# Altium schematic sheet main_borad.SCHDOC
size A0
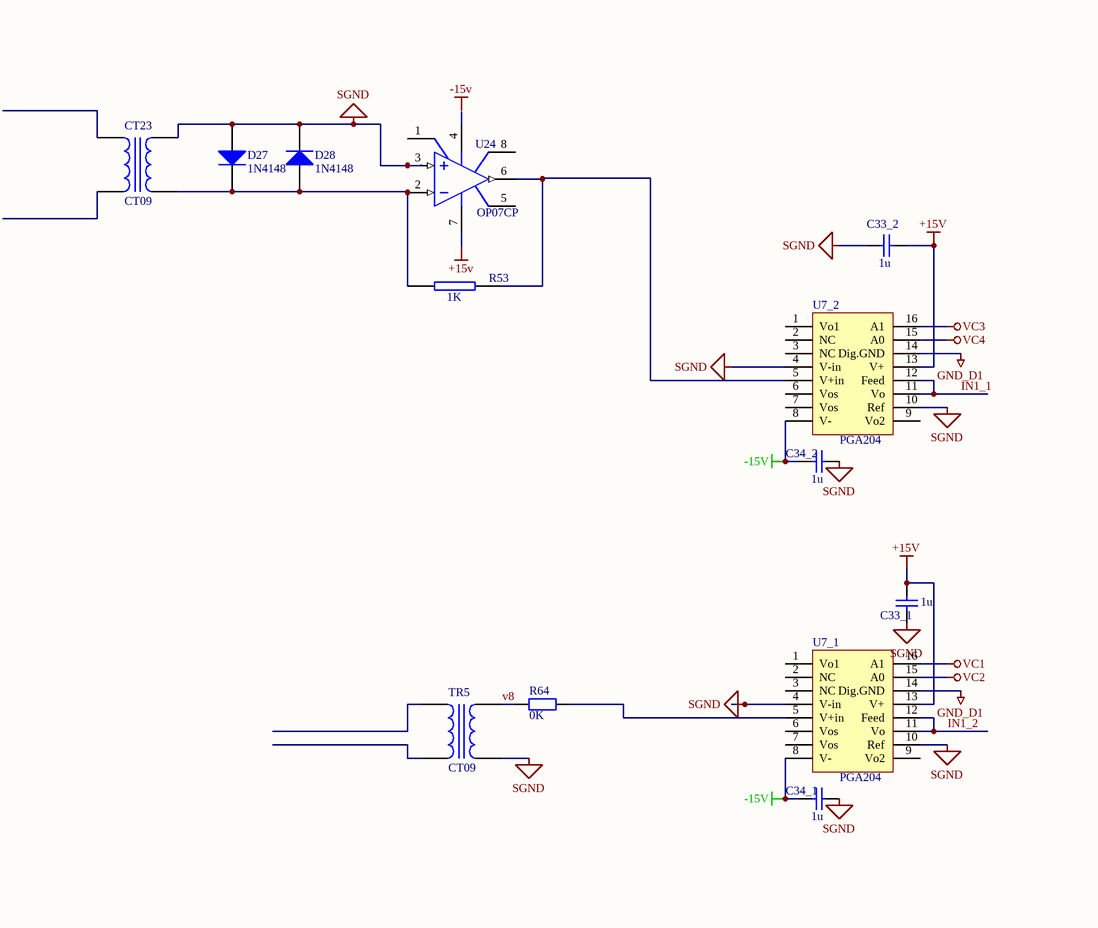
[diagram p0: main_borad.SCHDOC, top left]
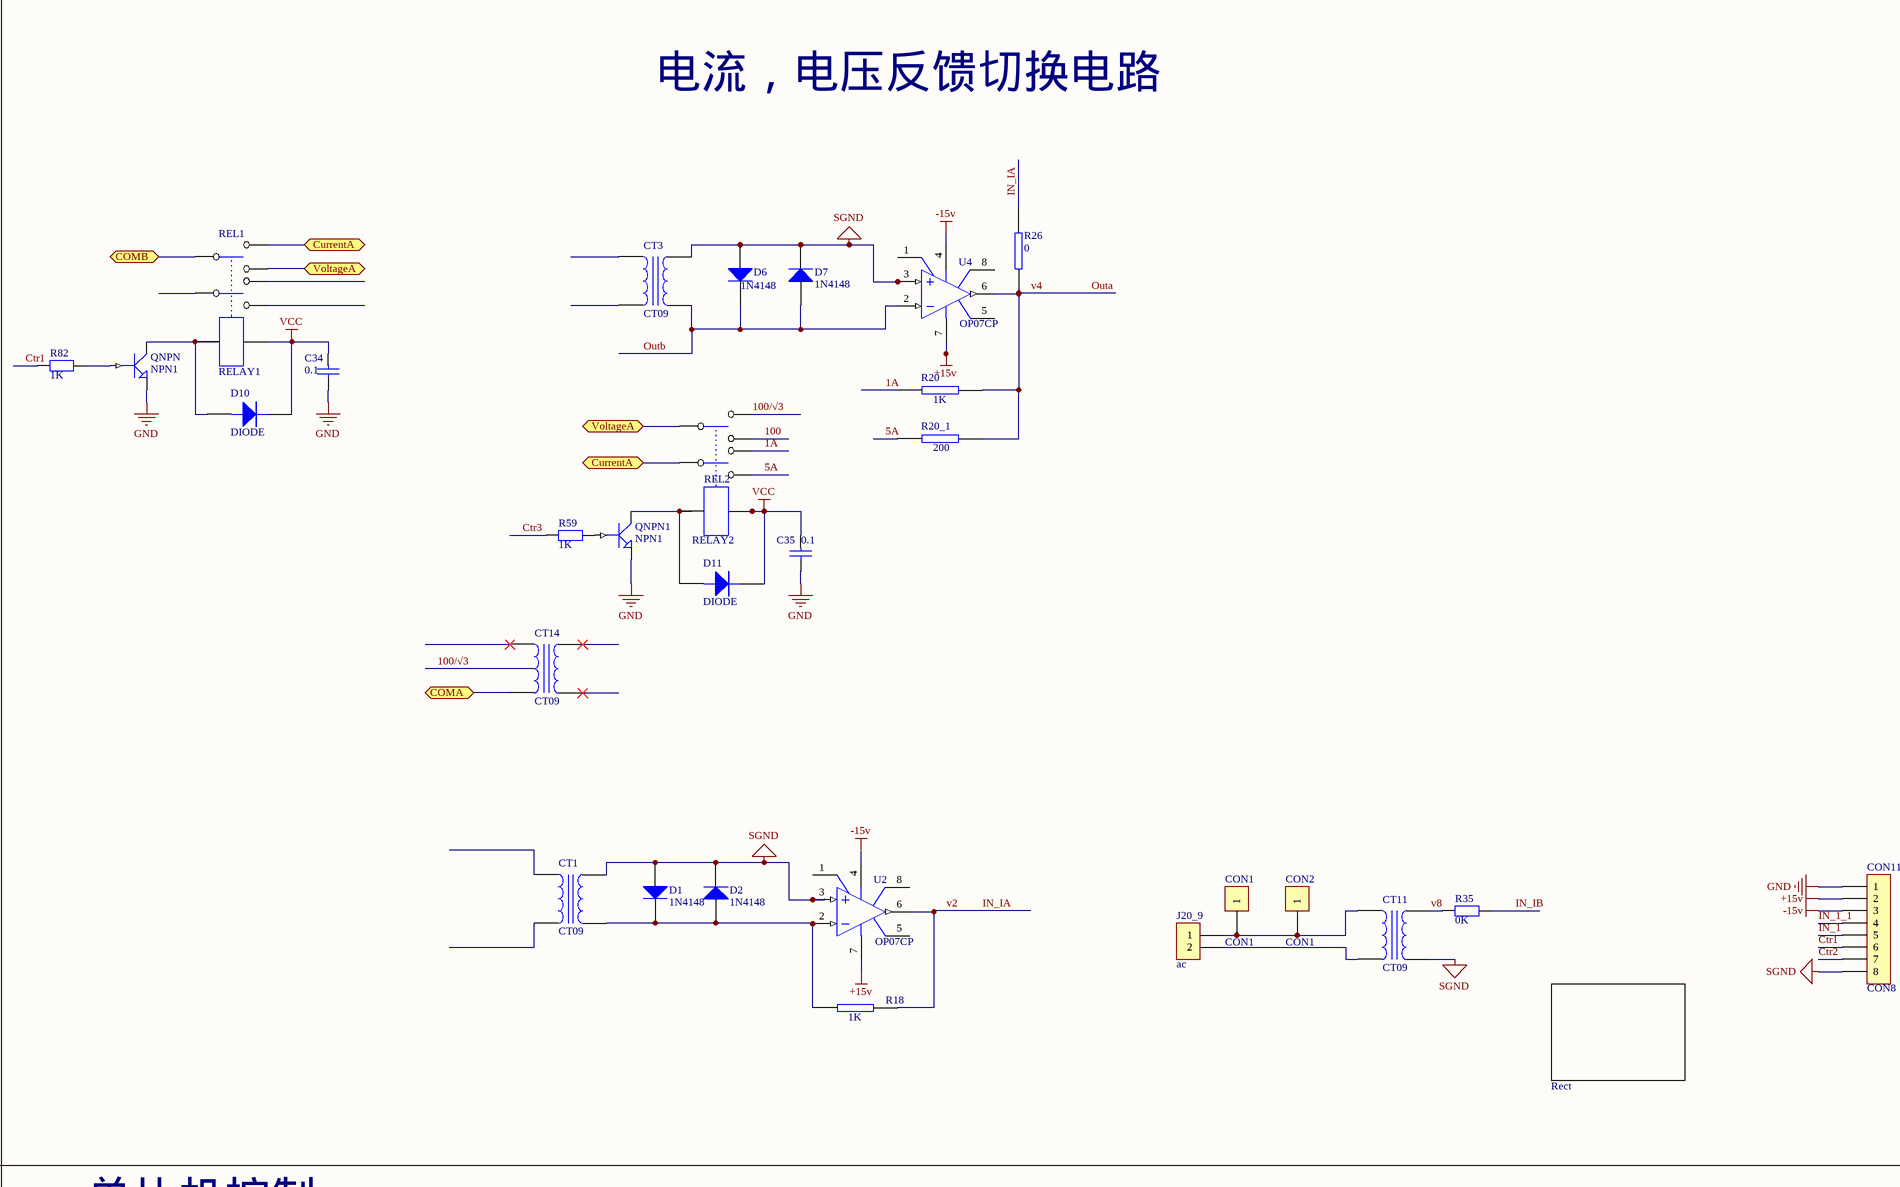
[diagram p1: main_borad.SCHDOC, top middle]
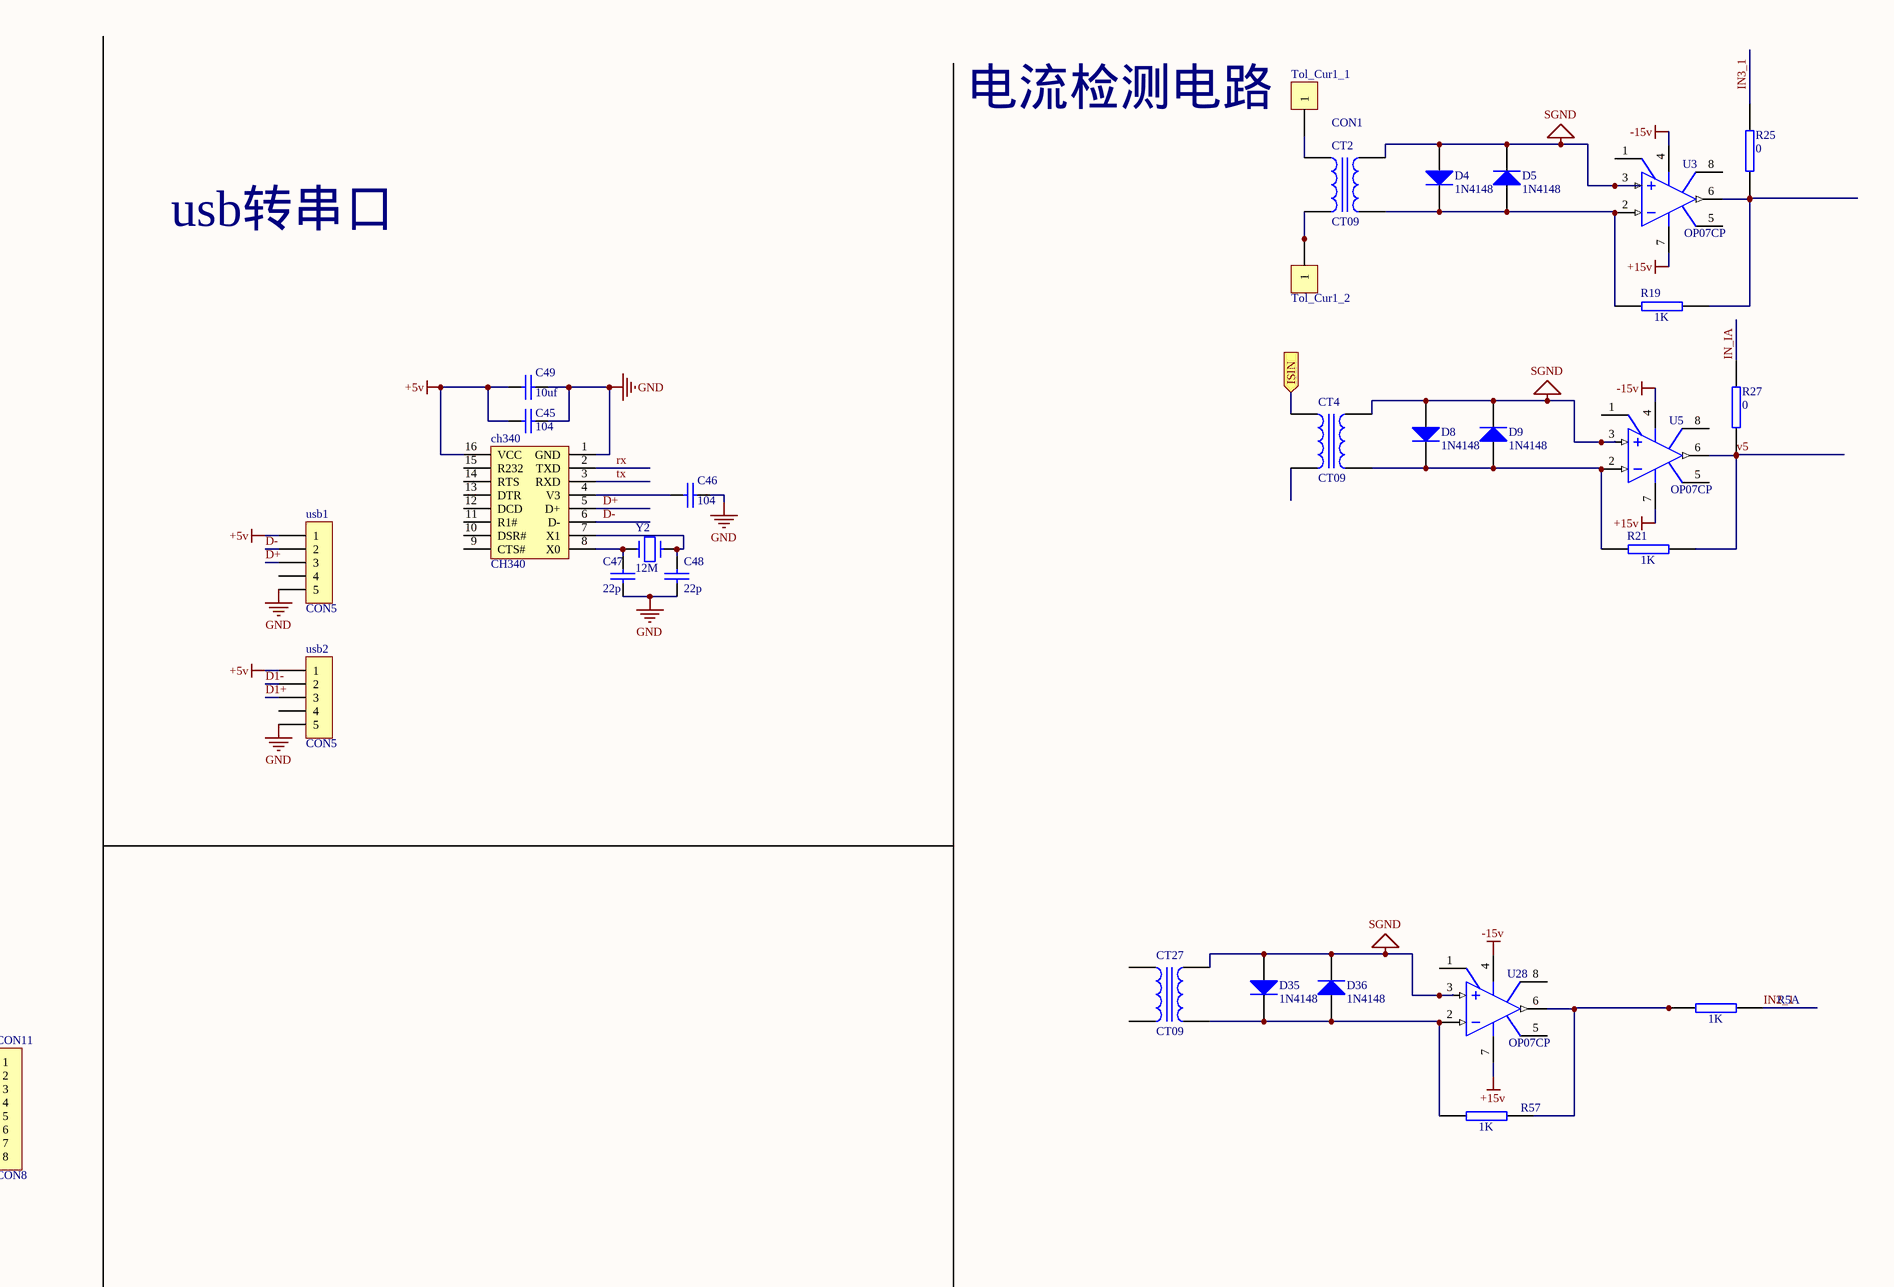
[diagram p2: main_borad.SCHDOC, top right]
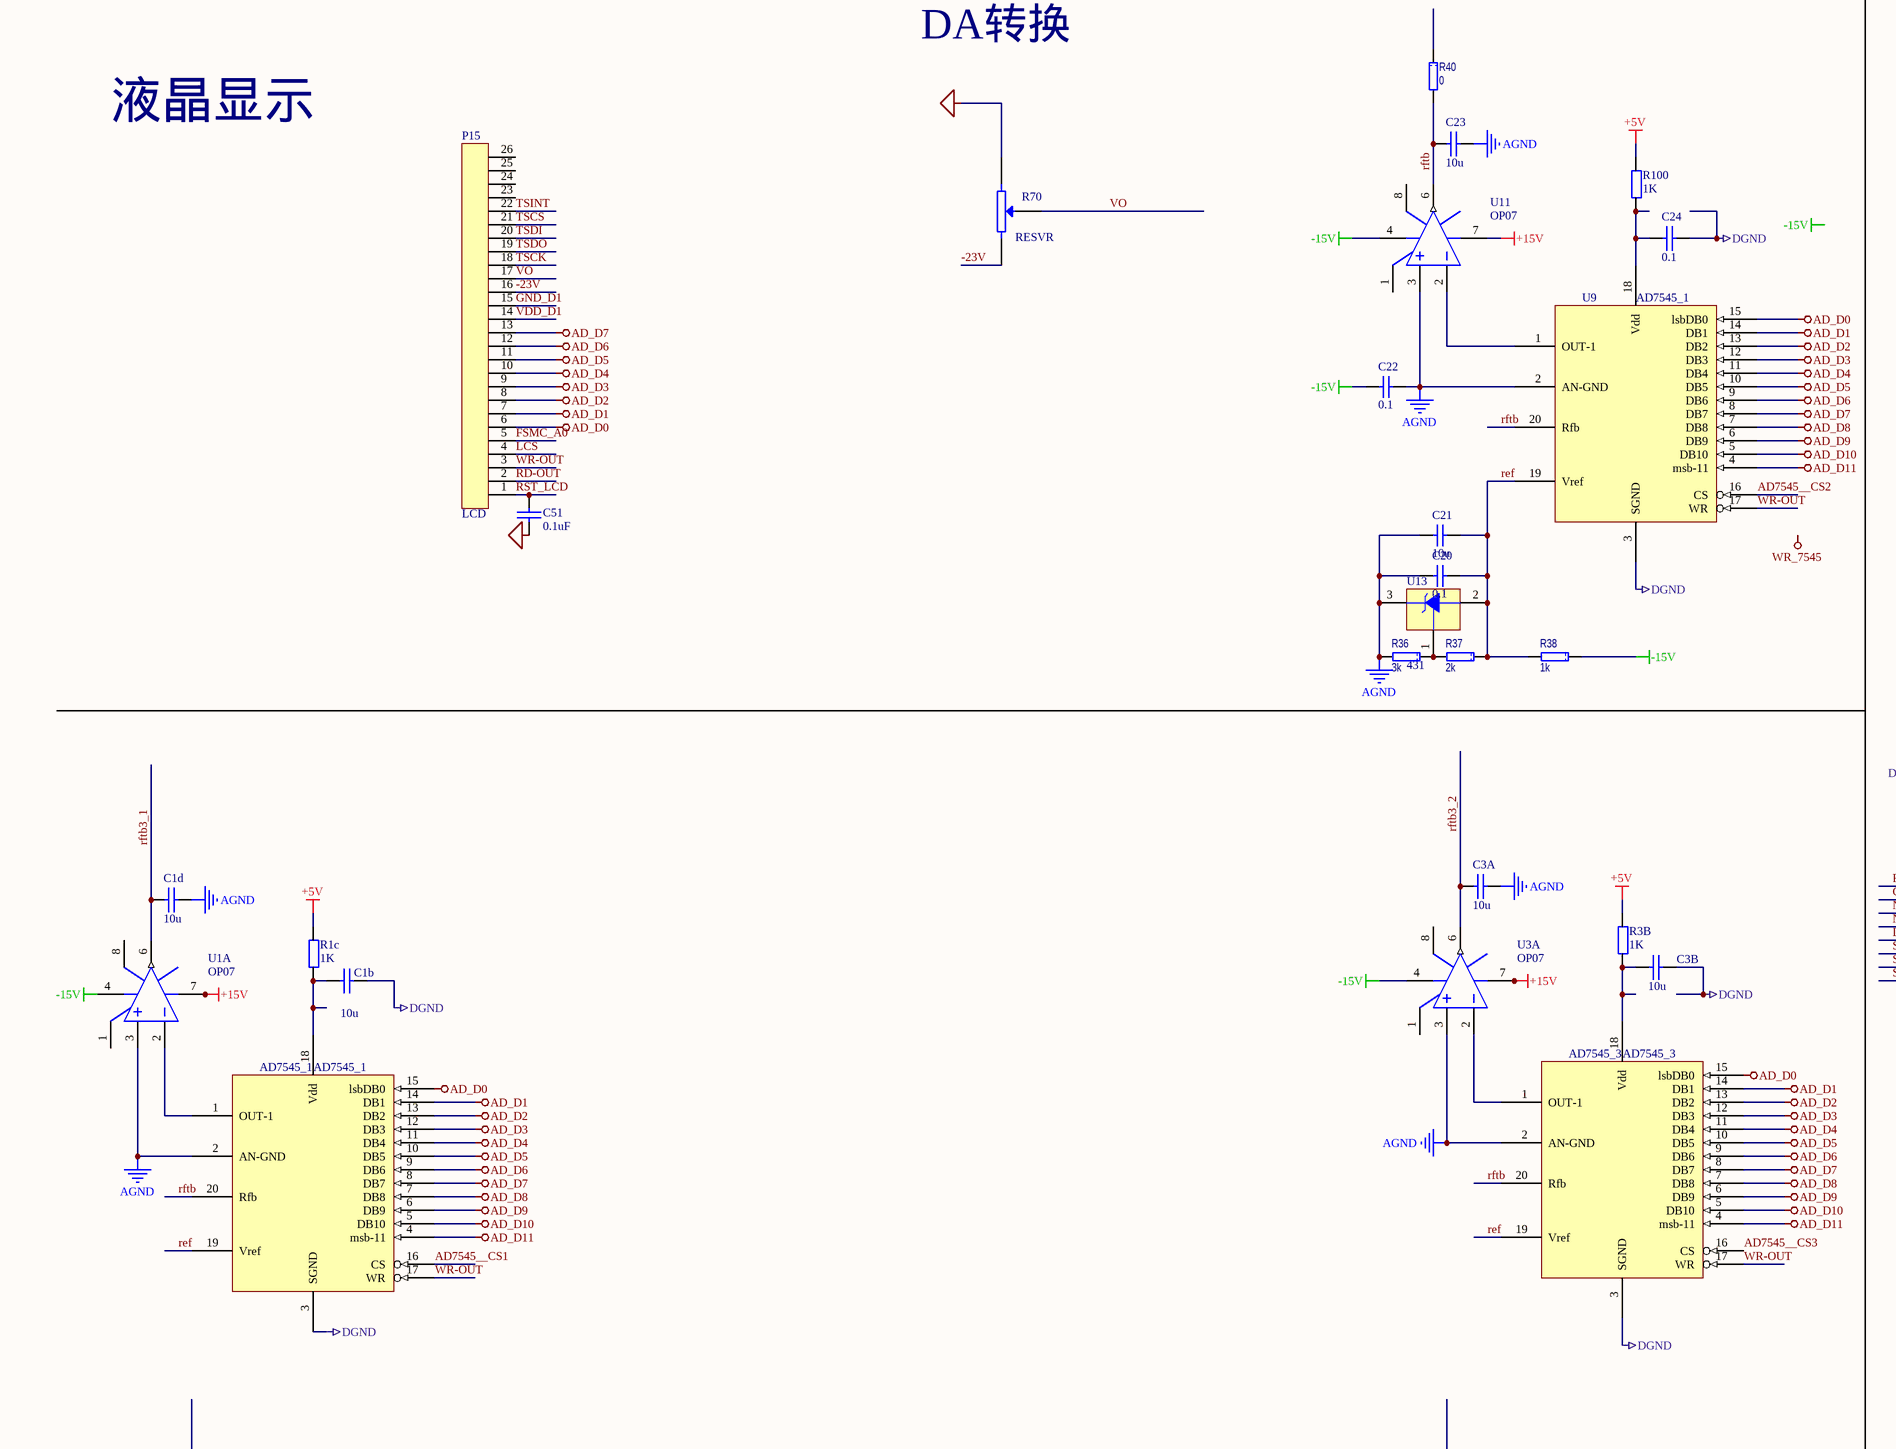
[diagram p3: main_borad.SCHDOC, centre left]
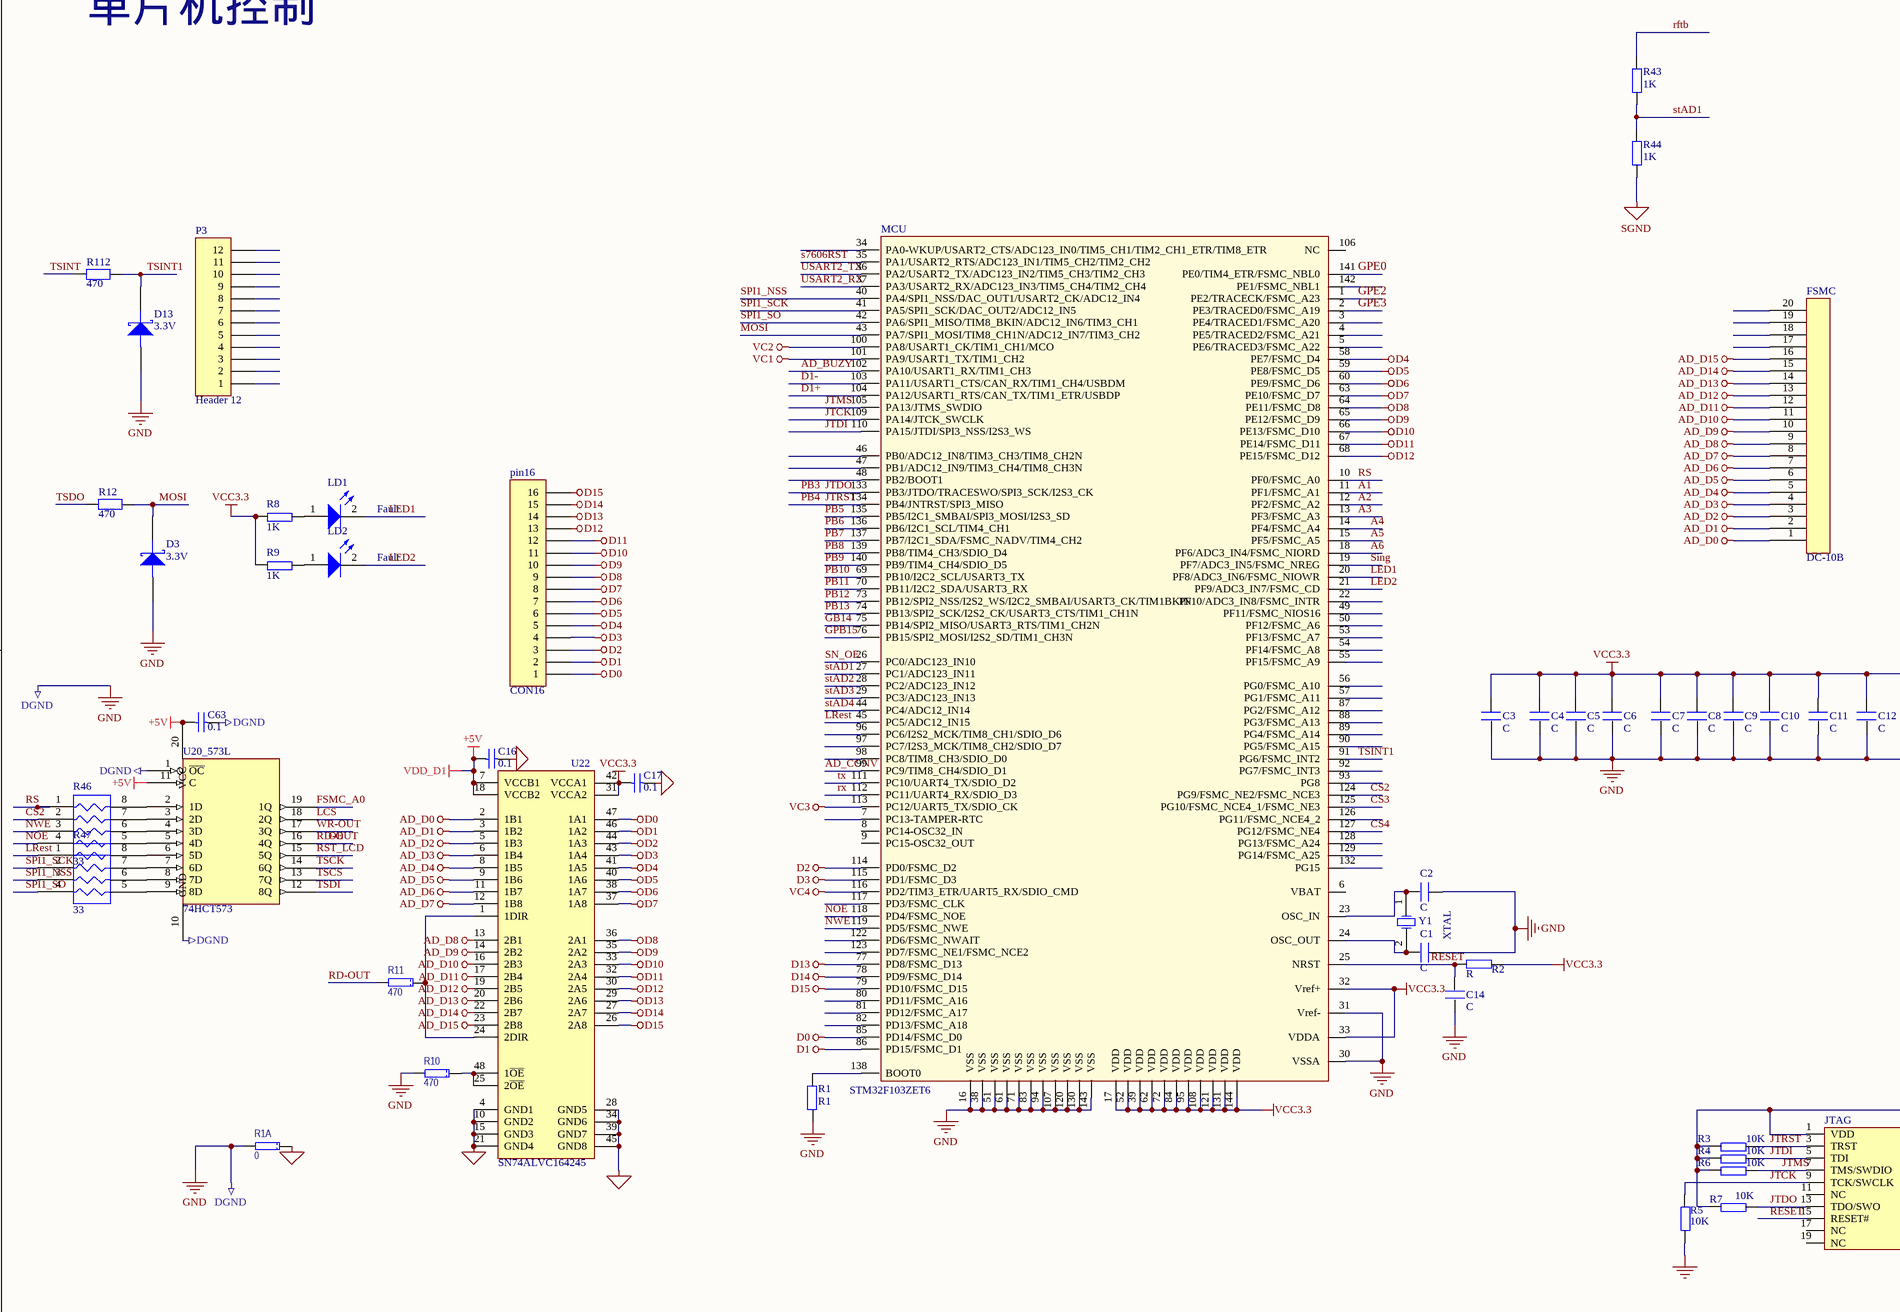
[diagram p4: main_borad.SCHDOC, centre middle]
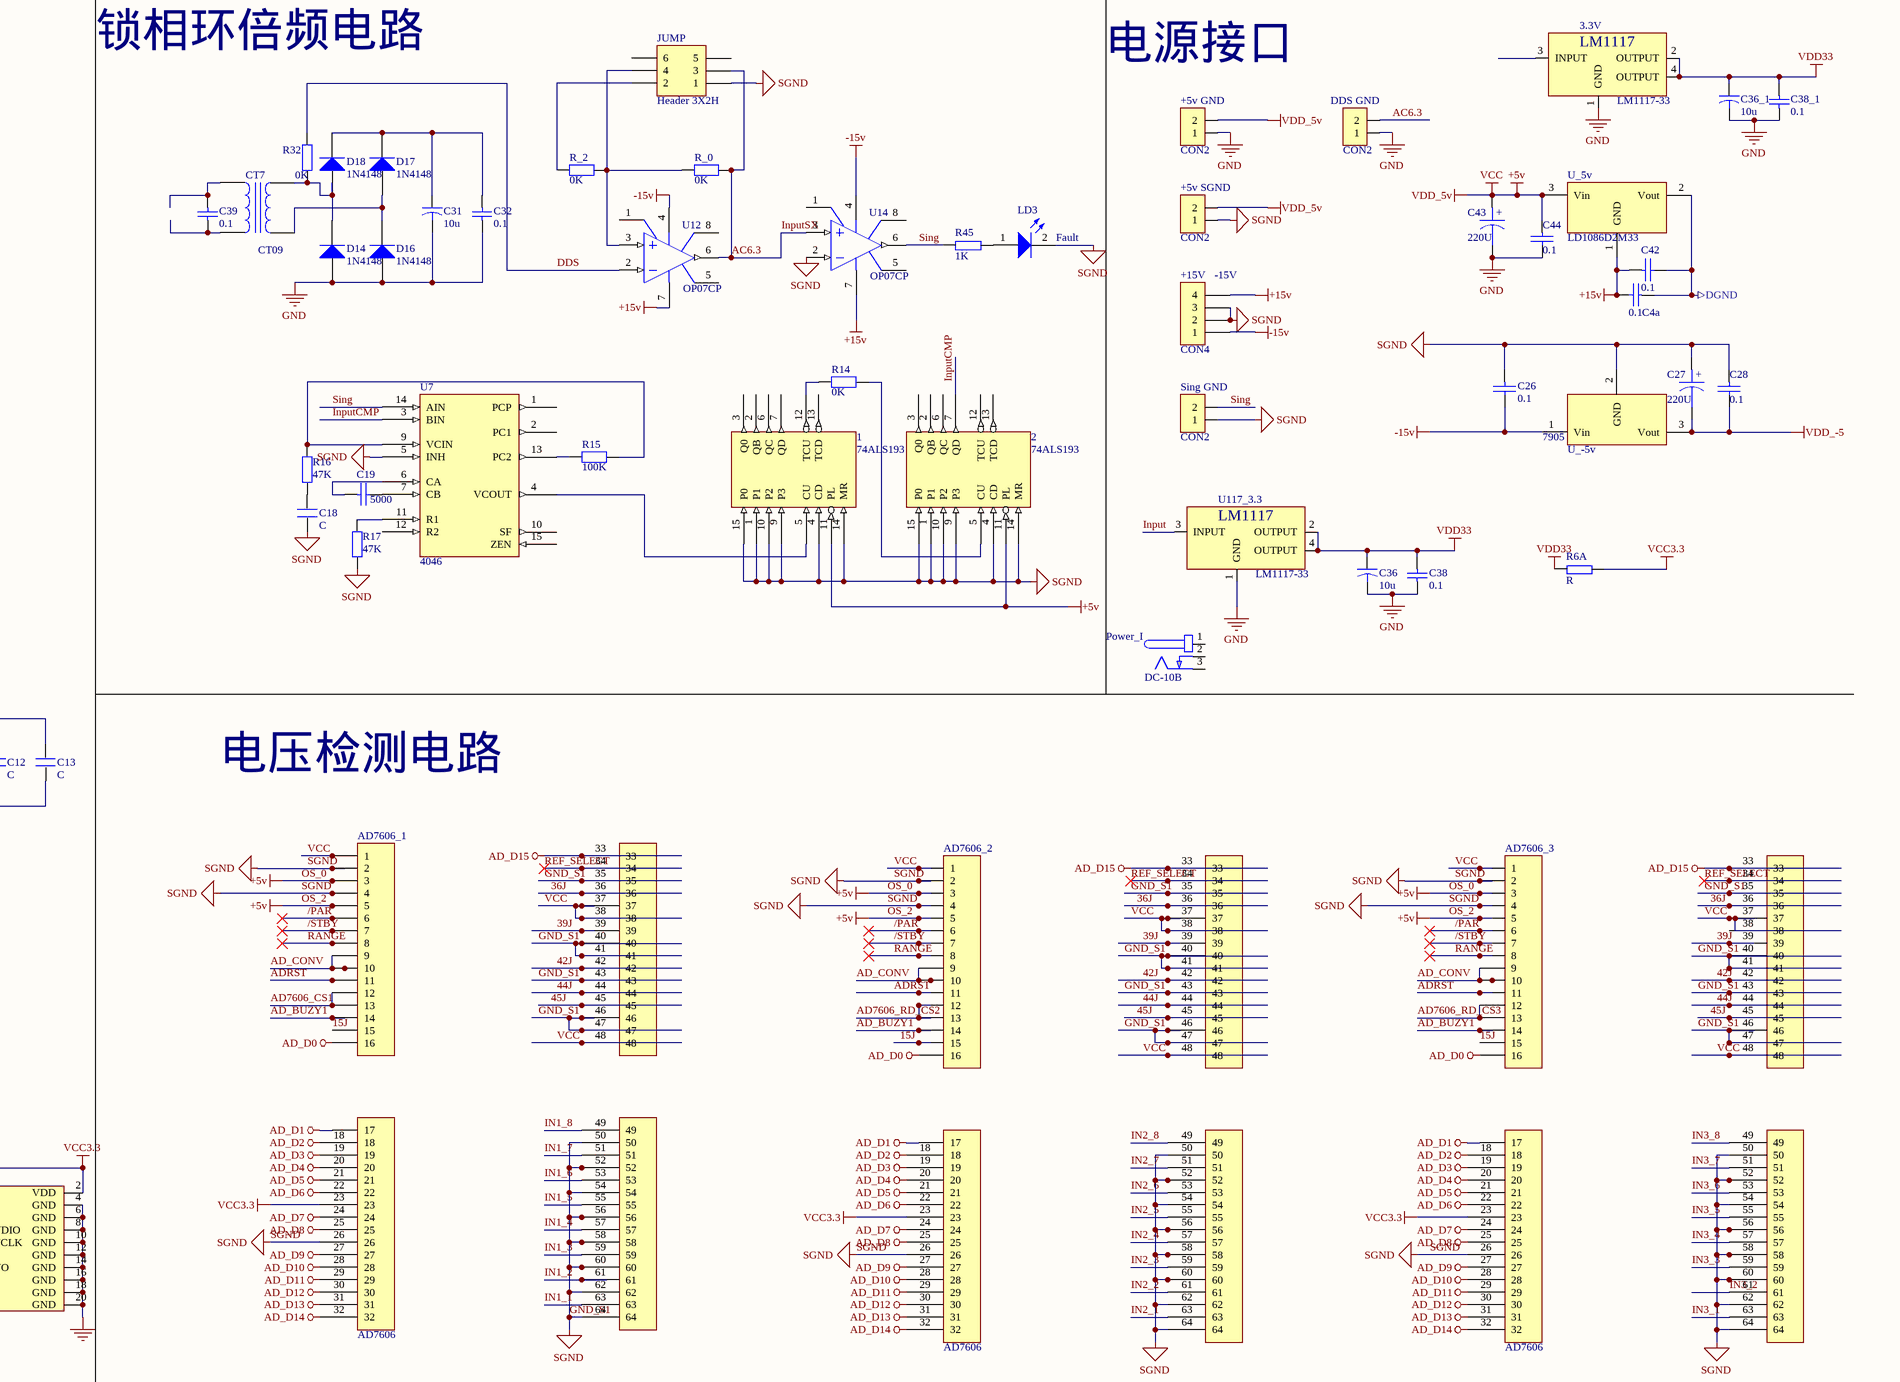
[diagram p5: main_borad.SCHDOC, centre right]
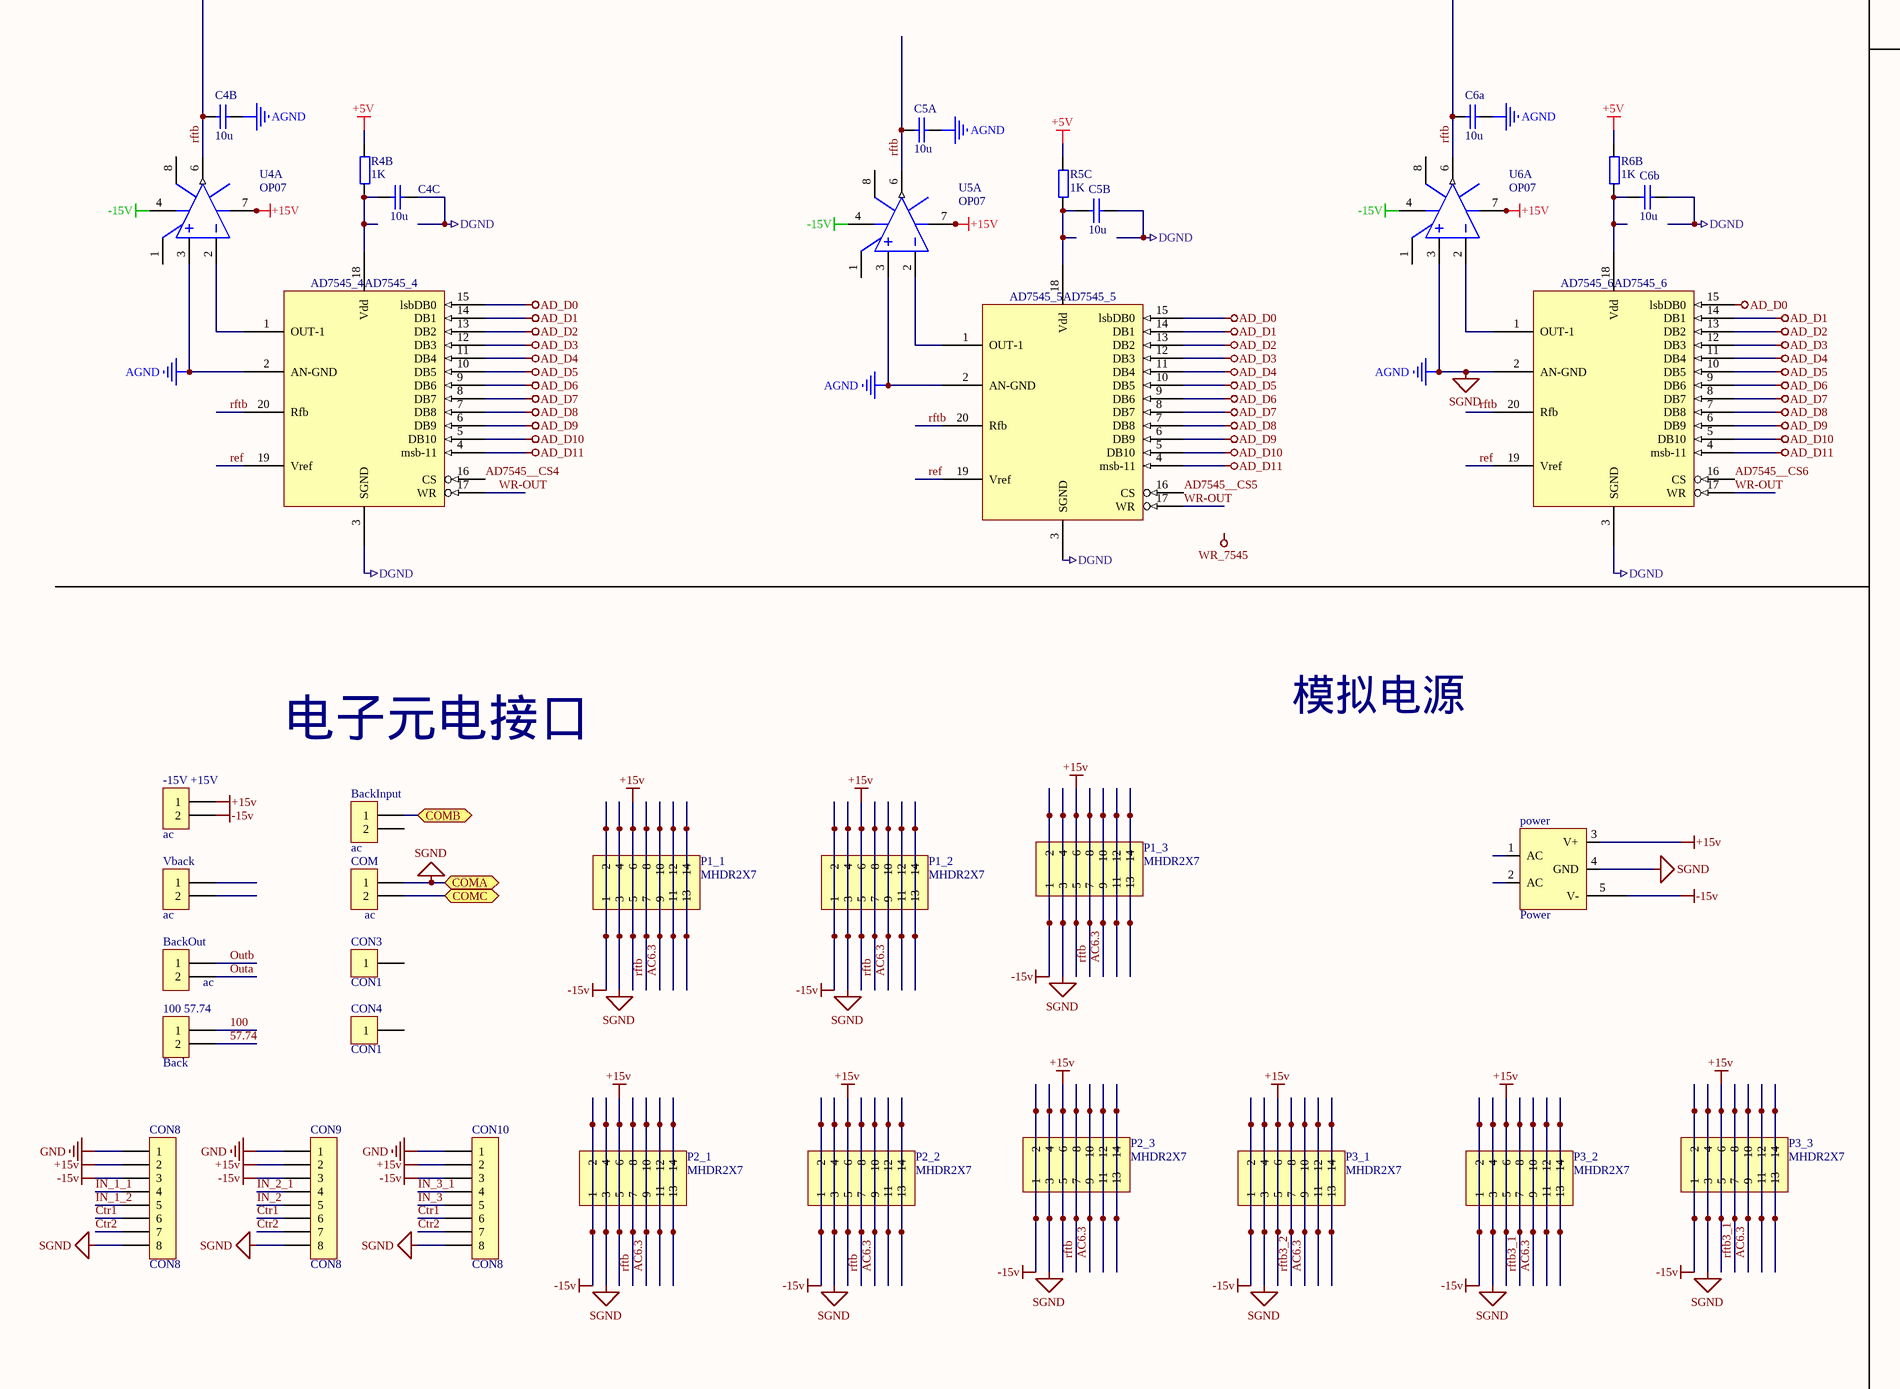
[diagram p6: main_borad.SCHDOC, bottom left]
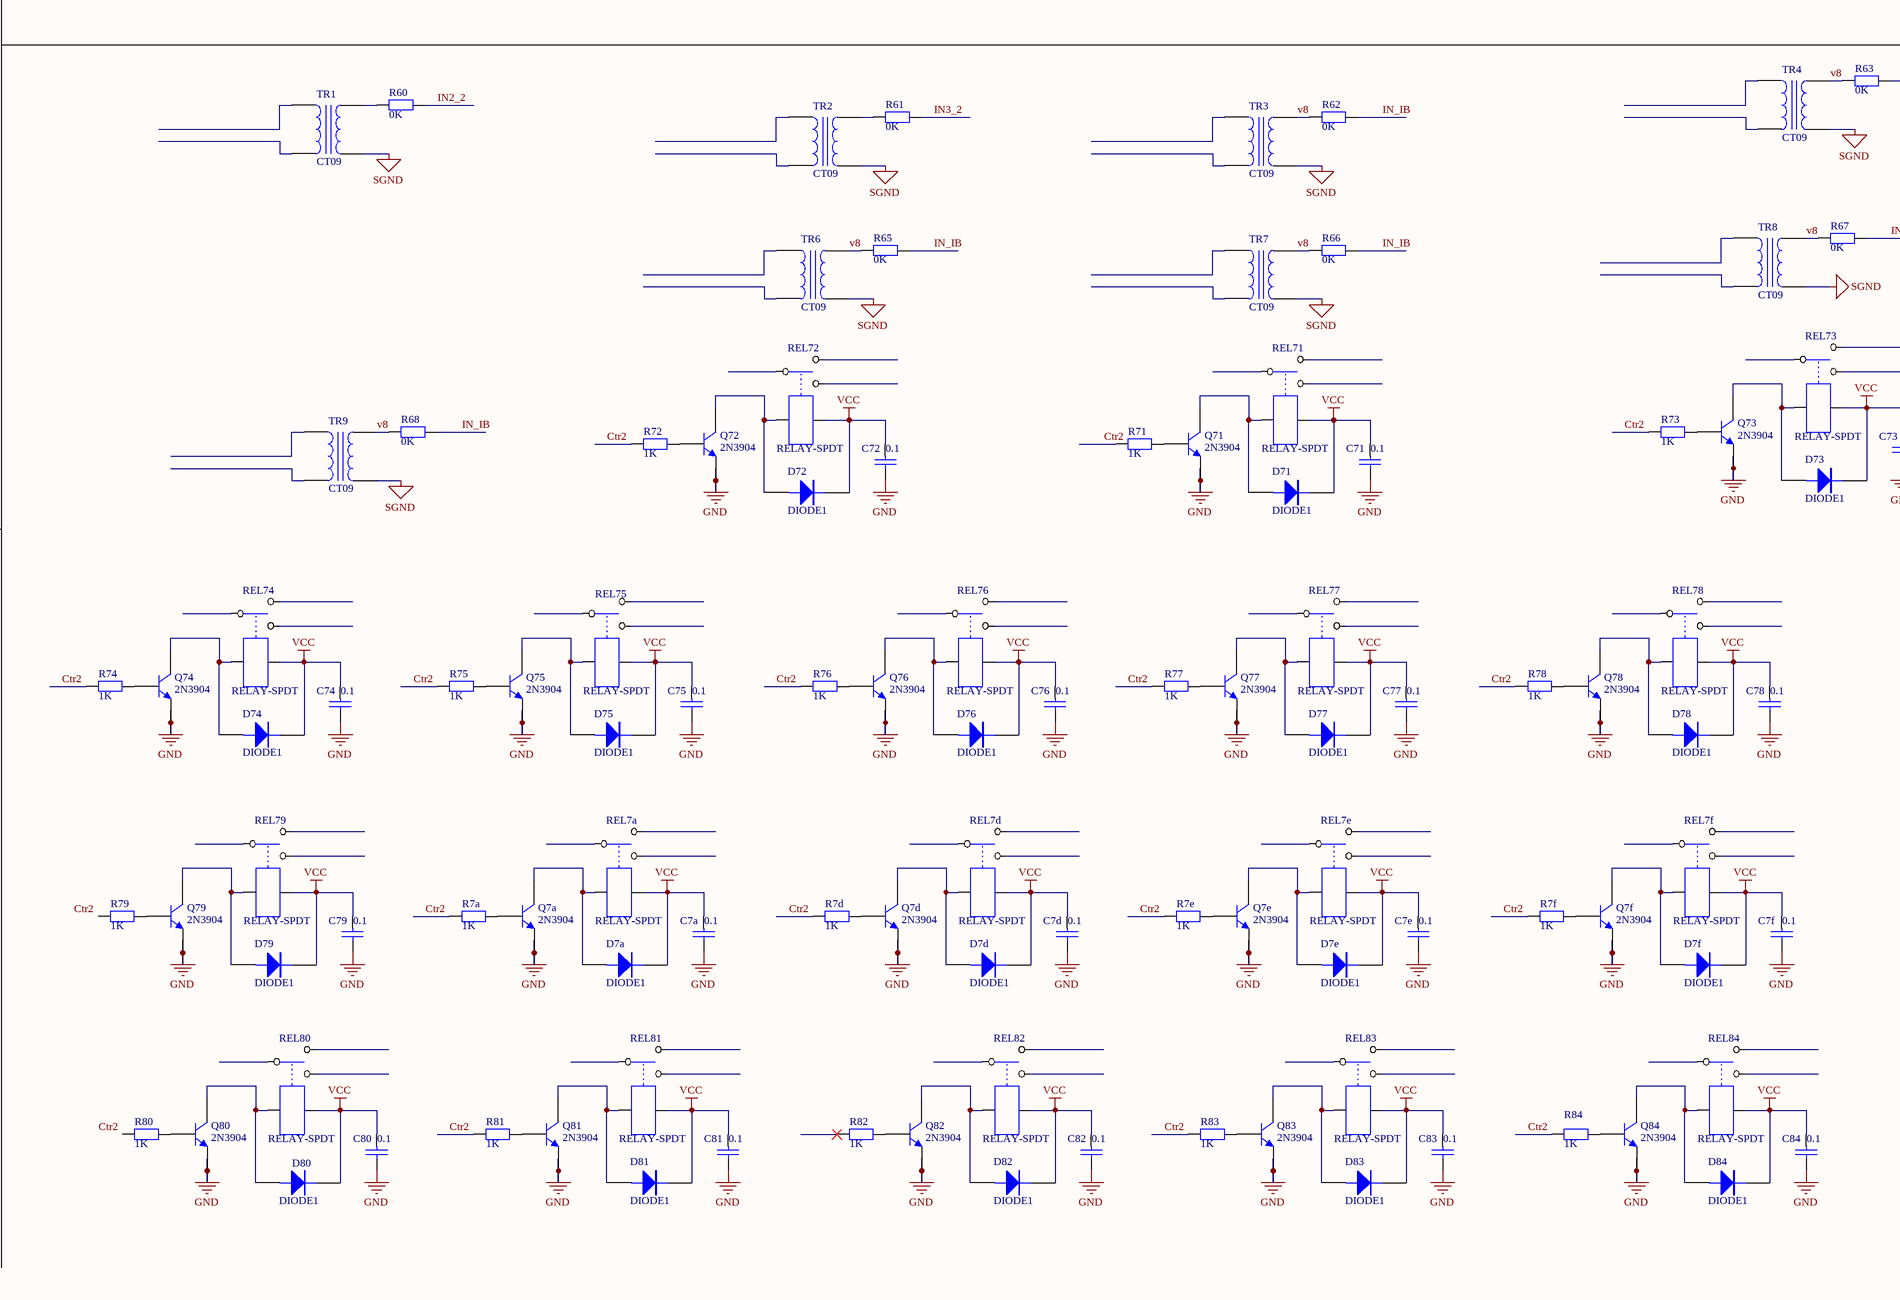
[diagram p7: main_borad.SCHDOC, bottom middle]
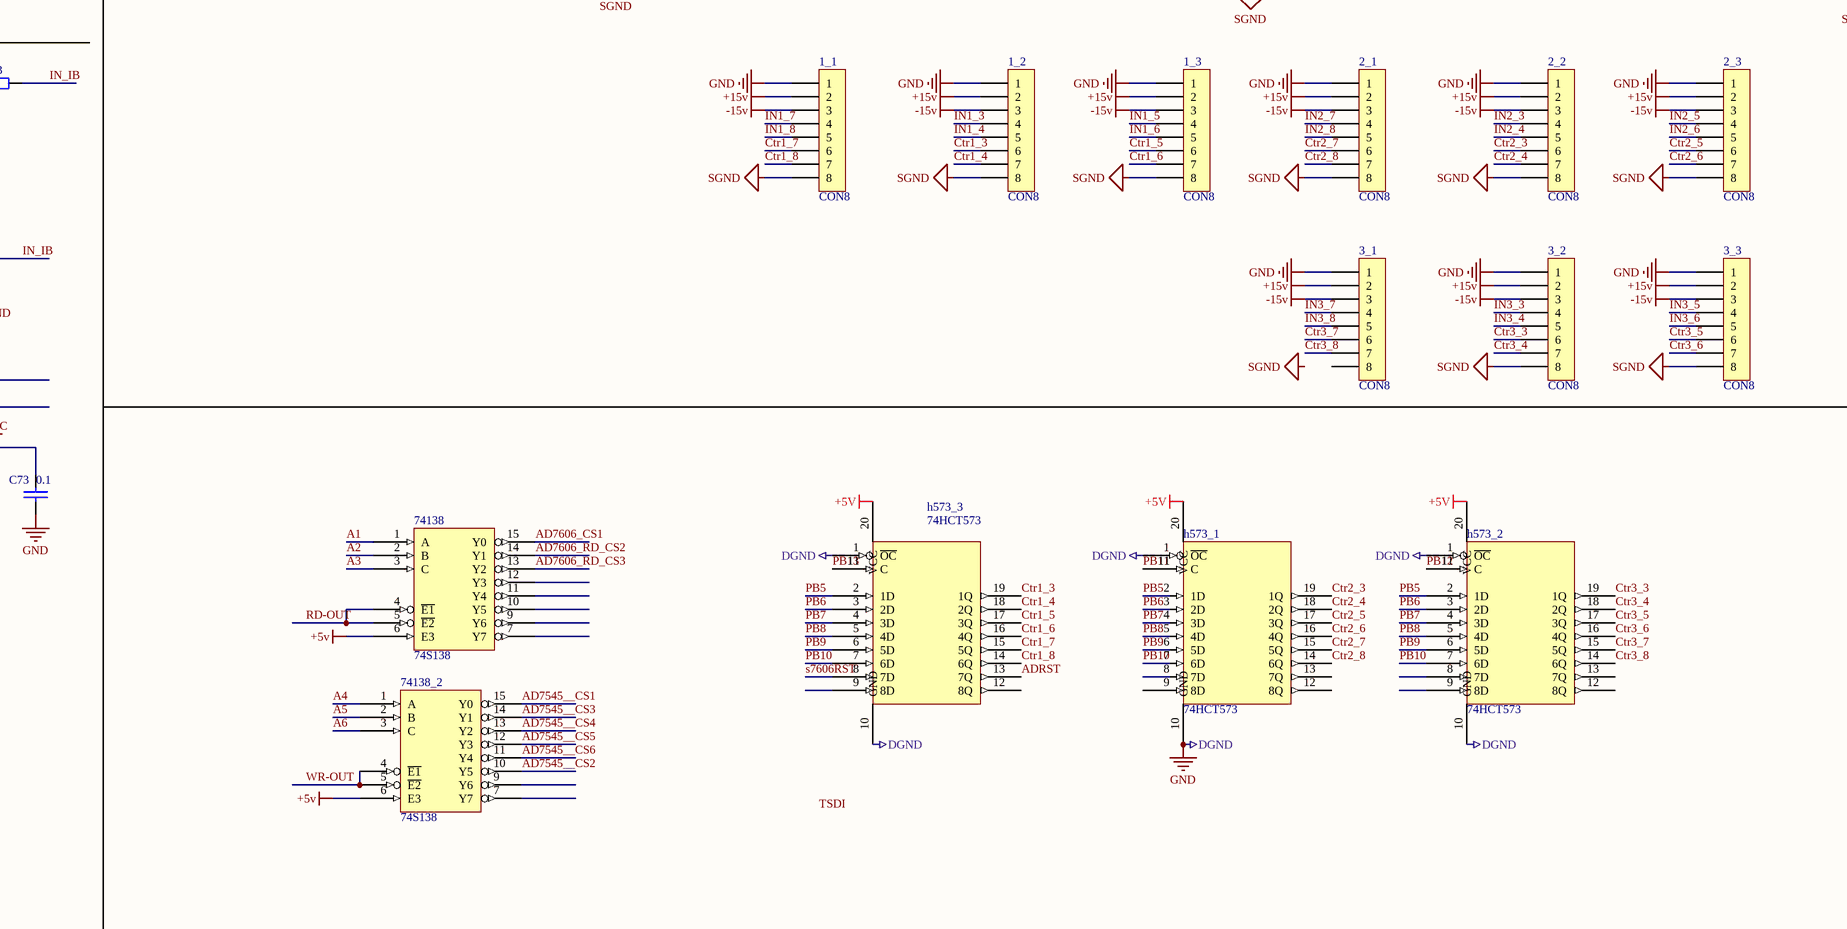
[diagram p8: main_borad.SCHDOC, bottom right]

## Parts
(Parts that share a designator on the sheet are numbered #1, #2 ... from top to bottom, then left to right.)
1  74ALS193  [SOP16]
1_1  CON8  [CON8]
1_2  CON8  [CON8]
1_3  CON8  [CON8]
2  74ALS193  [SOP16]
2_1  CON8  [CON8]
2_2  CON8  [CON8]
2_3  CON8  [CON8]
3.3V  LM1117-33  [SOT223]
3_1  CON8  [CON8]
3_2  CON8  [CON8]
3_3  CON8  [CON8]
100_57.74  Back  [TwoPowint]
74138  74S138  [SOP16]
74138_2  74S138  [SOP16]
*  Rect  [rectangle]
+5v_GND  CON2  [CON2]
+5v_SGND  CON2  [CON2]
+15V_-15V  CON4  [CON4]
-15V_+15V  ac  [TwoPowint]
AD7545_1  AD7545_1  [SO20-7.5]
AD7545_3  AD7545_3  [SO20-7.5]
AD7545_4  AD7545_4  [SO20-7.5]
AD7545_5  AD7545_5  [SO20-7.5]
AD7545_6  AD7545_6  [SO20-7.5]
AD7606_1  AD7606  [AD7606_4]
AD7606_2  AD7606  [AD7606_4]
AD7606_3  AD7606  [AD7606_4]
BackInput  ac  [TwoPowint]
BackOut  ac  [TwoPowint]
C1  C  [0805]
C1b  10u  [0805]
C1d  10u  [0805]
C2  C  [0805]
C3  C  [0603P]
C3A  10u  [0805]
C3B  10u  [0805]
C4  C  [0603P]
C4a  0.1  [0805]
C4B  10u  [0805]
C4C  10u  [0805]
C5  C  [0603P]
C5A  10u  [0805]
C5B  10u  [0805]
C6  C  [0603P]
C6a  10u  [0805]
C6b  10u  [0805]
C7  C  [0603P]
C7a  0.1  [0805]
C7d  0.1  [0805]
C7e  0.1  [0805]
C7f  0.1  [0805]
C8  C  [0603P]
C9  C  [0603P]
C10  C  [0603P]
C11  C  [0603P]
C12  C  [0603P]
C13  C  [0603P]
C14  C  [0805]
C16  0.1  [0805]
C17  0.1  [0805]
C18  C  [0805]
C19  5000  [0805]
C20  0.1  [0805]
C21  10u  [0805]
C22  0.1  [0805]
C23  10u  [0805]
C24  0.1  [0805]
C26  0.1  [0805]
C27  220U  [CD4]
C28  0.1  [0805]
C31  10u  [C-RVE]
C32  0.1  [0805]
C33_1  1u  [0805]
C33_2  1u  [0805]
C34  0.1  [0805]
C34_1  1u  [0805]
C34_2  1u  [0805]
C35  0.1  [0805]
C36  10u  [c-1206]
C36_1  10u  [c-1206]
C38  0.1  [0805]
C38_1  0.1  [0805]
C39  0.1  [C400]
C42  0.1  [c-1206]
C43  220U  [CD4]
C44  0.1  [0805]
C45  104  [0805]
C46  104  [0805]
C47  22p  [0805]
C48  22p  [0805]
C49  10uf  [0805]
C51  0.1uF  [0805]
C63  0.1  [0805]
C71  0.1  [0805]
C72  0.1  [0805]
C73  0.1  [0805]
C74  0.1  [0805]
C75  0.1  [0805]
C76  0.1  [0805]
C77  0.1  [0805]
C78  0.1  [0805]
C79  0.1  [0805]
C80  0.1  [0805]
C81  0.1  [0805]
C82  0.1  [0805]
C83  0.1  [0805]
C84  0.1  [0805]
ch340  CH340  [SOP16]
COM  ac  [TwoPowint]
CON1  CON1  [Powint]
CON2  CON1  [Powint]
CON3  CON1  [Powint]
CON4  CON1  [Powint]
CON8  CON8  [CON8]
CON9  CON8  [CON8]
CON10  CON8  [CON8]
CON11  CON8  [CON8]
CT1  CT09  [Inducter_1]
CT2  CT09  [Inducter_1]
CT3  CT09  [inducter_2]
CT4  CT09  [Inducter_1]
CT7  CT09  [tra1]
CT11  CT09  [tra1]
CT14  CT09
CT23  CT09  [Inducter_1]
CT27  CT09  [Inducter_1]
D1  1N4148  [1504D]
D2  1N4148  [1504D]
D3  3.3V  [1206]
D4  1N4148  [1504D]
D5  1N4148  [1504D]
D6  1N4148  [1504D]
D7  1N4148  [1504D]
D7a  DIODE1  [DiodeSVC]
D7d  DIODE1  [DiodeSVC]
D7e  DIODE1  [DiodeSVC]
D7f  DIODE1  [DiodeSVC]
D8  1N4148  [1504D]
D9  1N4148  [1504D]
D10  DIODE  [DiodeSVC]
D11  DIODE  [DiodeSVC]
D13  3.3V  [1206]
D14  1N4148  [1504D]
D16  1N4148  [1504D]
D17  1N4148  [1504D]
D18  1N4148  [1504D]
D27  1N4148  [1504D]
D28  1N4148  [1504D]
D35  1N4148  [1504D]
D36  1N4148  [1504D]
D71  DIODE1  [DiodeSVC]
D72  DIODE1  [DiodeSVC]
D73  DIODE1  [DiodeSVC]
D74  DIODE1  [DiodeSVC]
D75  DIODE1  [DiodeSVC]
D76  DIODE1  [DiodeSVC]
D77  DIODE1  [DiodeSVC]
D78  DIODE1  [DiodeSVC]
D79  DIODE1  [DiodeSVC]
D80  DIODE1  [DiodeSVC]
D81  DIODE1  [DiodeSVC]
D82  DIODE1  [DiodeSVC]
D83  DIODE1  [DiodeSVC]
D84  DIODE1  [DiodeSVC]
DDS_GND  CON2  [CON2]
FSMC  DC-10B  [SIP20]
h573_1  74HCT573  [M20D]
h573_2  74HCT573  [M20D]
h573_3  74HCT573  [M20D]
J20_9  ac  [TwoPowint]
JTAG  (no value)  [JTAG_20]
JUMP  Header 3X2H  [HDR2X3]
LD1  Fault  [0805C]
LD2  Fault  [0805C]
LD3  Fault  [0805C]
MCU  STM32F103ZET6  [LQFP144]
P1_1  MHDR2X7  [MHDR2X7]
P1_2  MHDR2X7  [MHDR2X7]
P1_3  MHDR2X7  [MHDR2X7]
P2_1  MHDR2X7  [MHDR2X7]
P2_2  MHDR2X7  [MHDR2X7]
P2_3  MHDR2X7  [MHDR2X7]
P3  Header 12  [HDR1X12]
P3_1  MHDR2X7  [MHDR2X7]
P3_2  MHDR2X7  [MHDR2X7]
P3_3  MHDR2X7  [MHDR2X7]
P15  LCD  [LCD_CM]
pin16  CON16  [CON16]
power  Power  [power]
Power_I  DC-10B  [DC10B]
Q7a  2N3904  [SOT-23]
Q7d  2N3904  [SOT-23]
Q7e  2N3904  [SOT-23]
Q7f  2N3904  [SOT-23]
Q71  2N3904  [SOT-23]
Q72  2N3904  [SOT-23]
Q73  2N3904  [SOT-23]
Q74  2N3904  [SOT-23]
Q75  2N3904  [SOT-23]
Q76  2N3904  [SOT-23]
Q77  2N3904  [SOT-23]
Q78  2N3904  [SOT-23]
Q79  2N3904  [SOT-23]
Q80  2N3904  [SOT-23]
Q81  2N3904  [SOT-23]
Q82  2N3904  [SOT-23]
Q83  2N3904  [SOT-23]
Q84  2N3904  [SOT-23]
QNPN  NPN1  [SOT-23]
QNPN1  NPN1  [SOT-23]
R1  R1  [0805]
R1A  0  [0805]
R1c  1K  [0805]
R2  R  [0805]
R3  10K  [0805]
R3B  1K  [0805]
R4  10K  [0805]
R4B  1K  [0805]
R5  10K  [0805]
R5A  1K  [0805]
R5C  1K  [0805]
R6  10K  [0805]
R6A  R  [0805]
R6B  1K  [0805]
R7  10K  [0805]
R7a  1K  [0805]
R7d  1K  [0805]
R7e  1K  [0805]
R7f  1K  [0805]
R8  1K  [0805]
R9  1K  [0805]
R10  470  [0805]
R11  470  [0805]
R12  470  [0805]
R14  0K  [0805]
R15  100K  [0805]
R16  47K  [0805]
R17  47K  [0805]
R18  1K  [0805]
R19  1K  [0805]
R20  1K  [0805]
R20_1  200  [0805]
R21  1K  [0805]
R25  0  [0805]
R26  0  [0805]
R27  0  [0805]
R32  0K  [0805]
R35  0K  [0805]
R36  3k  [0805]
R37  2k  [0805]
R38  1k  [0805]
R40  0  [0805]
R43  1K  [0805]
R44  1K  [0805]
R45  1K  [0805]
R46  33  [8P4R_0603]
R47  33  [8P4R_0603]
R53  1K  [0805]
R57  1K  [0805]
R59  1K  [0805]
R60  0K  [0805]
R61  0K  [0805]
R62  0K  [0805]
R63  0K  [0805]
R64  0K  [0805]
R65  0K  [0805]
R66  0K  [0805]
R67  0K  [0805]
R68  0K  [0805]
R70  RESVR  [RESVR]
R71  1K  [0805]
R72  1K  [0805]
R73  1K  [0805]
R74  1K  [0805]
R75  1K  [0805]
R76  1K  [0805]
R77  1K  [0805]
R78  1K  [0805]
R79  1K  [0805]
R80  1K  [0805]
R81  1K  [0805]
R82#1  1K  [0805]
R82#2  1K  [0805]
R83  1K  [0805]
R84  1K  [0805]
R100  1K  [0805]
R112  470  [0805]
R_0  0K  [0805]
R_2  0K  [0805]
REL1  RELAY1  [N4099-5D]
REL2  RELAY2  [N4099-5D]
REL7a  RELAY-SPDT  [JQC-3FF]
REL7d  RELAY-SPDT  [JQC-3FF]
REL7e  RELAY-SPDT  [JQC-3FF]
REL7f  RELAY-SPDT  [JQC-3FF]
REL71  RELAY-SPDT  [JQC-3FF]
REL72  RELAY-SPDT  [JQC-3FF]
REL73  RELAY-SPDT  [JQC-3FF]
REL74  RELAY-SPDT  [JQC-3FF]
REL75  RELAY-SPDT  [JQC-3FF]
REL76  RELAY-SPDT  [JQC-3FF]
REL77  RELAY-SPDT  [JQC-3FF]
REL78  RELAY-SPDT  [JQC-3FF]
REL79  RELAY-SPDT  [JQC-3FF]
REL80  RELAY-SPDT  [JQC-3FF]
REL81  RELAY-SPDT  [JQC-3FF]
REL82  RELAY-SPDT  [JQC-3FF]
REL83  RELAY-SPDT  [JQC-3FF]
REL84  RELAY-SPDT  [JQC-3FF]
Sing_GND  CON2  [CON2]
Tol_Cur1_1  CON1  [MiniPoint]
Tol_Cur1_2  CON1  [MiniPoint]  (value not drawn)
TR1  CT09  [tra1]
TR2  CT09  [tra1]
TR3  CT09  [tra1]
TR4  CT09  [tra1]
TR5  CT09  [tra1]
TR6  CT09  [tra1]
TR7  CT09  [tra1]
TR8  CT09  [tra1]
TR9  CT09  [tra1]
U1A  OP07  [SOP127P600X175-8N]
U2  OP07CP  [SOP127P600X175-8N]
U3  OP07CP  [SOP127P600X175-8N]
U3A  OP07  [SOP127P600X175-8N]
U4  OP07CP  [SOP127P600X175-8N]
U4A  OP07  [SOP127P600X175-8N]
U5  OP07CP  [SOP127P600X175-8N]
U5A  OP07  [SOP127P600X175-8N]
U6A  OP07  [SOP127P600X175-8N]
U7  4046  [SOP16]
U7_1  PGA204  [DIP16]
U7_2  PGA204  [DIP16]
U9  AD7545_1  [SO20-7.5]
U11  OP07  [SOP127P600X175-8N]
U12  OP07CP  [SOP127P600X175-8N]
U13  431  [29-04]
U14  OP07CP  [SOP127P600X175-8N]
U20_573L  74HCT573  [M20D]
U22  SN74ALVC164245  [SSOP48]
U24  OP07CP  [SOP127P600X175-8N]
U28  OP07CP  [SOP127P600X175-8N]
U117_3.3  LM1117-33  [SOT223]
U_5v  LD1086D2M33  [D2PAK/A]
U_-5v  7905  [TO220H]
usb1  CON5  [USB-MICRO-AB]
usb2  CON5  [USB-MICRO-AB]
Vback  ac  [TwoPowint]
Y1  XTAL  [XTAL_US]
Y2  12M  [XTAL_US]

## Ports
COMA, COMB, COMC, CurrentA, ISIN, VoltageA

## Nets
+15v: 1_1.2 1_2.2 1_3.2 2_1.2 2_2.2 2_3.2 3_1.2 3_2.2 3_3.2 +15V_-15V.4 -15V_+15V.1 C4a.2 C33_1.2 C33_2.1 C42.1 CON8.2 CON9.2 CON10.2 CON11.2 P1_1.5 P1_1.6 P1_2.5 P1_2.6 P1_3.5 P1_3.6 P2_1.5 P2_1.6 P2_2.5 P2_2.6 P2_3.5 P2_3.6 P3_1.5 P3_1.6 P3_2.5 P3_2.6 P3_3.5 P3_3.6 power.3(V+) U1A.7(V+) U2.7(V+) U3.7(V+) U3A.7(V+) U4.7(V+) U4A.7(V+) U5.7(V+) U5A.7(V+) U6A.7(V+) U7_1.13(V+) U7_2.13(V+) U11.7(V+) U12.7(V+) U14.7(V+) U24.7(V+) U28.7(V+) U_5v.1(GND)
-15v: 1_1.3 1_2.3 1_3.3 2_1.3 2_2.3 2_3.3 3_1.3 3_2.3 3_3.3 +15V_-15V.1 -15V_+15V.2 C22.2 C26.2 C34_1.2 C34_2.2 CON8.3 CON9.3 CON10.3 CON11.3 P1_1.1 P1_1.2 P1_2.1 P1_2.2 P1_3.1 P1_3.2 P2_1.1 P2_1.2 P2_2.1 P2_2.2 P2_3.1 P2_3.2 P3_1.1 P3_1.2 P3_2.1 P3_2.2 P3_3.1 P3_3.2 power.5(V-) R38.1 U1A.4(V-) U3.4(V-) U3A.4(V-) U4.4(V-) U4A.4(V-) U5.4(V-) U5A.4(V-) U6A.4(V-) U7_1.8(V-) U7_2.8(V-) U11.4(V-) U12.4(V-) U14.4(V-) U28.4(V-) U_-5v.1(Vin)
AD_D0: AD7545_1.15(lsbDB0) AD7545_3.15(lsbDB0) AD7545_4.15(lsbDB0) AD7545_5.15(lsbDB0) AD7545_6.15(lsbDB0) AD7606_1.16 AD7606_2.16 AD7606_3.16 FSMC.1 P15.6 U9.15(lsbDB0) U22.2(1B1)
AD_D1: AD7545_1.14(DB1) AD7545_3.14(DB1) AD7545_4.14(DB1) AD7545_5.14(DB1) AD7545_6.14(DB1) AD7606_1.17 AD7606_2.17 AD7606_3.17 FSMC.2 P15.7 U9.14(DB1) U22.3(1B2)
AD_D2: AD7545_1.13(DB2) AD7545_3.13(DB2) AD7545_4.13(DB2) AD7545_5.13(DB2) AD7545_6.13(DB2) AD7606_1.18 AD7606_2.18 AD7606_3.18 FSMC.3 P15.8 U9.13(DB2) U22.5(1B3)
AD_D3: AD7545_1.12(DB3) AD7545_3.12(DB3) AD7545_4.12(DB3) AD7545_5.12(DB3) AD7545_6.12(DB3) AD7606_1.19 AD7606_2.19 AD7606_3.19 FSMC.4 P15.9 U9.12(DB3) U22.6(1B4)
AD_D4: AD7545_1.11(DB4) AD7545_3.11(DB4) AD7545_4.11(DB4) AD7545_5.11(DB4) AD7545_6.11(DB4) AD7606_1.20 AD7606_2.20 AD7606_3.20 FSMC.5 P15.10 U9.11(DB4) U22.8(1B5)
AD_D5: AD7545_1.10(DB5) AD7545_3.10(DB5) AD7545_4.10(DB5) AD7545_5.10(DB5) AD7545_6.10(DB5) AD7606_1.21 AD7606_2.21 AD7606_3.21 FSMC.6 P15.11 U9.10(DB5) U22.9(1B6)
AD_D6: AD7545_1.9(DB6) AD7545_3.9(DB6) AD7545_4.9(DB6) AD7545_5.9(DB6) AD7545_6.9(DB6) AD7606_1.22 AD7606_2.22 AD7606_3.22 FSMC.7 P15.12 U9.9(DB6) U22.11(1B7)
AD_D7: AD7545_1.8(DB7) AD7545_3.8(DB7) AD7545_4.8(DB7) AD7545_5.8(DB7) AD7545_6.8(DB7) AD7606_1.24 AD7606_2.24 AD7606_3.24 FSMC.8 P15.13 U9.8(DB7) U22.12(1B8)
AD_D8: AD7545_1.7(DB8) AD7545_3.7(DB8) AD7545_4.7(DB8) AD7545_5.7(DB8) AD7545_6.7(DB8) AD7606_1.25 AD7606_2.25 AD7606_3.25 FSMC.9 U9.7(DB8) U22.13(2B1)
AD_D9: AD7545_1.6(DB9) AD7545_3.6(DB9) AD7545_4.6(DB9) AD7545_5.6(DB9) AD7545_6.6(DB9) AD7606_1.27 AD7606_2.27 AD7606_3.27 FSMC.10 U9.6(DB9) U22.14(2B2)
AD_D10: AD7545_1.5(DB10) AD7545_3.5(DB10) AD7545_4.5(DB10) AD7545_5.5(DB10) AD7545_6.5(DB10) AD7606_1.28 AD7606_2.28 AD7606_3.28 FSMC.11 U9.5(DB10) U22.16(2B3)
AD_D11: AD7545_1.4(msb-11) AD7545_3.4(msb-11) AD7545_4.4(msb-11) AD7545_5.4(msb-11) AD7545_6.4(msb-11) AD7606_1.29 AD7606_2.29 AD7606_3.29 FSMC.12 U9.4(msb-11) U22.17(2B4)
AD_D12: AD7606_1.30 AD7606_2.30 AD7606_3.30 FSMC.13 U22.19(2B5)
AD_D13: AD7606_1.31 AD7606_2.31 AD7606_3.31 FSMC.14 U22.20(2B6)
AD_D14: AD7606_1.32 AD7606_2.32 AD7606_3.32 FSMC.15 U22.22(2B7)
AD_D15: AD7606_1.33 AD7606_2.33 AD7606_3.33 FSMC.16 U22.23(2B8)
D0: MCU.85(PD14/FSMC_D0) pin16.1 U22.47(1A1)
D1: MCU.86(PD15/FSMC_D1) pin16.2 U22.46(1A2)
D2: MCU.114(PD0/FSMC_D2) pin16.3 U22.44(1A3)
D3: MCU.115(PD1/FSMC_D3) pin16.4 U22.43(1A4)
D4: MCU.58(PE7/FSMC_D4) pin16.5 U22.41(1A5)
D5: MCU.59(PE8/FSMC_D5) pin16.6 U22.40(1A6)
D6: MCU.60(PE9/FSMC_D6) pin16.7 U22.38(1A7)
D7: MCU.63(PE10/FSMC_D7) pin16.8 U22.37(1A8)
D8: MCU.64(PE11/FSMC_D8) pin16.9 U22.36(2A1)
D9: MCU.65(PE12/FSMC_D9) pin16.10 U22.35(2A2)
D10: MCU.66(PE13/FSMC_D10) pin16.11 U22.33(2A3)
D11: MCU.67(PE14/FSMC_D11) pin16.12 U22.32(2A4)
D12: MCU.68(PE15/FSMC_D12) pin16.13 U22.30(2A5)
D13: MCU.77(PD8/FSMC_D13) pin16.14 U22.29(2A6)
D14: MCU.78(PD9/FSMC_D14) pin16.15 U22.27(2A7)
D15: MCU.79(PD10/FSMC_D15) pin16.16 U22.26(2A8)
DGND: 1.8(GND) 1_1.1 1_2.1 1_3.1 2.8(GND) 2_1.1 2_2.1 2_3.1 3.3V.1(GND) 3_1.1 3_2.1 3_3.1 74138.8(GND) 74138_2.8(GND) +5v_GND.1 AD7545_1.3(SGND) AD7545_3.3(SGND) AD7545_4.3(SGND) AD7545_5.3(SGND) AD7545_6.3(SGND) C1.1 C1b.2 C2.1 C3.1 C3B.2 C4.1 C4a.1 C4C.2 C5.1 C5B.2 C6.1 C6b.2 C7.1 C7a.2 C7d.2 C7e.2 C7f.2 C8.1 C9.1 C10.1 C11.1 C12.1 C13.1 C14.1 C24.2 C31.2 C32.2 C34.2 C35.2 C36.2 C36_1.2 C38.2 C38_1.2 C42.2 C43.2 C44.2 C45.2 C46.2 C47.1 C48.1 C49.2 C63.1 C71.2 C72.2 C73.2 C74.2 C75.2 C76.2 C77.2 C78.2 C79.2 C80.2 C81.2 C82.2 C83.2 C84.2 ch340.1(GND) CON8.1 CON9.1 CON10.1 CON11.1 D3.1(A) D13.1(A) D14.1(A) D16.1(A) DDS_GND.1 h573_1.1(~{OC}) h573_1.10(GND) h573_2.1(~{OC}) h573_2.10(GND) h573_3.1(~{OC}) h573_3.10(GND) JTAG.4(GND) JTAG.6(GND) JTAG.8(GND) JTAG.10(GND) JTAG.12(GND) JTAG.14(GND) JTAG.16(GND) JTAG.18(GND) JTAG.20(GND) MCU.16(VSS) MCU.30(VSSA) MCU.31(Vref-) MCU.38(VSS) MCU.51(VSS) MCU.61(VSS) MCU.71(VSS) MCU.83(VSS) MCU.94(VSS) MCU.107(VSS) MCU.120(VSS) MCU.130(VSS) MCU.143(VSS) Q7a.1(E) Q7d.1(E) Q7e.1(E) Q7f.1(E) Q71.1(E) Q72.1(E) Q73.1(E) Q74.1(E) Q75.1(E) Q76.1(E) Q77.1(E) Q78.1(E) Q79.1(E) Q80.1(E) Q81.1(E) Q82.1(E) Q83.1(E) Q84.1(E) QNPN.3(E) QNPN1.3(E) R1.2 R1A.2 R5.1 R10.2 U7.8(GND) U9.3(SGND) U20_573L.1(~{OC}) U20_573L.10(GND) U117_3.3.1(GND) U_5v.2(Vout) usb1.5 usb2.5  [also labelled GND]
GND_D1: C16.2 C17.2 C51.2 P15.15 R1A.1 R70.1 U7_1.14(Dig.GND) U7_2.14(Dig.GND) U22.4(GND1) U22.10(GND2) U22.15(GND3) U22.21(GND4) U22.28(GND5) U22.34(GND6) U22.39(GND7) U22.45(GND8)
GND_S1: 1.1(P1) 1.4(CD) 1.9(P3) 1.10(P2) 1.14(MR) 1.15(P0) 1_1.8 1_2.8 1_3.8 2.1(P1) 2.4(CD) 2.9(P3) 2.10(P2) 2.14(MR) 2.15(P0) 2_1.8 2_2.8 2_3.8 3_2.8 3_3.8 +5v_SGND.1 +15V_-15V.2 +15V_-15V.3 AD7545_1.2(AN-GND) AD7545_3.2(AN-GND) AD7545_4.2(AN-GND) AD7545_5.2(AN-GND) AD7545_6.2(AN-GND) AD7606_1.2 AD7606_1.4 AD7606_1.26 AD7606_1.35 AD7606_1.40 AD7606_1.41 AD7606_1.43 AD7606_1.46 AD7606_1.47 AD7606_1.50 AD7606_1.52 AD7606_1.54 AD7606_1.56 AD7606_1.58 AD7606_1.60 AD7606_1.62 AD7606_1.64 AD7606_2.2 AD7606_2.4 AD7606_2.26 AD7606_2.35 AD7606_2.40 AD7606_2.41 AD7606_2.43 AD7606_2.46 AD7606_2.47 AD7606_2.50 AD7606_2.52 AD7606_2.54 AD7606_2.56 AD7606_2.58 AD7606_2.60 AD7606_2.62 AD7606_2.64 AD7606_3.2 AD7606_3.4 AD7606_3.26 AD7606_3.35 AD7606_3.40 AD7606_3.41 AD7606_3.43 AD7606_3.46 AD7606_3.47 AD7606_3.50 AD7606_3.52 AD7606_3.54 AD7606_3.56 AD7606_3.58 AD7606_3.60 AD7606_3.62 AD7606_3.64 C1d.1 C3A.1 C4B.1 C5A.1 C6a.1 C18.1 C20.2 C21.2 C22.1 C23.1 C26.1 C27.1 C28.1 C33_1.1 C33_2.2 C34_1.1 C34_2.1 COM.1 CON8.8 CON9.8 CON10.8 CON11.8 CT1.2 CT2.2 CT3.2 CT4.2 CT11.1 CT14.4 CT23.2 CT27.2 D1.1(A) D2.2(K) D4.1(A) D5.2(K) D6.1(A) D7.2(K) D8.1(A) D9.2(K) D27.1(A) D28.2(K) D35.1(A) D36.2(K) JUMP.1 LD3.2(K) P1_1.3 P1_1.4 P1_2.3 P1_2.4 P1_3.3 P1_3.4 P2_1.3 P2_1.4 P2_2.3 P2_2.4 P2_3.3 P2_3.4 P3_1.3 P3_1.4 P3_2.3 P3_2.4 P3_3.3 P3_3.4 power.4(GND) R17.1 R36.2 R44.1 Sing_GND.1 TR1.1 TR2.1 TR3.1 TR4.1 TR5.1 TR6.1 TR7.1 TR8.1 TR9.1 U1A.3(IN+) U2.3(IN+) U3.3(IN+) U3A.3(IN+) U4.3(IN+) U4A.3(IN+) U5.3(IN+) U5A.3(IN+) U6A.3(IN+) U7.5(INH) U7_1.4(V-in) U7_1.10(Ref) U7_2.4(V-in) U7_2.10(Ref) U9.2(AN-GND) U11.3(IN+) U13.3(K) U14.2(IN-) U24.3(IN+) U28.3(IN+) U_-5v.2(GND) ; port COMA  [also labelled AGND, SGND]
OS_0: 1.11(PL) 1.16(VCC) 2.11(PL) 2.16(VCC) 74138.6(E3) 74138.16(VCC) 74138_2.6(E3) 74138_2.16(VCC) +5v_GND.2 +5v_SGND.2 AD7606_1.1 AD7606_1.3 AD7606_1.5 AD7606_1.37 AD7606_1.38 AD7606_1.48 AD7606_2.1 AD7606_2.3 AD7606_2.5 AD7606_2.37 AD7606_2.38 AD7606_2.48 AD7606_3.1 AD7606_3.3 AD7606_3.5 AD7606_3.37 AD7606_3.48 C7a.1 C7d.1 C7e.1 C7f.1 C16.1 C34.1 C35.1 C43.1 C44.1 C45.1 C49.1 C63.2 C71.1 C72.1 C73.1 C74.1 C75.1 C76.1 C77.1 C78.1 C79.1 C80.1 C81.1 C82.1 C83.1 C84.1 ch340.16(VCC) D7a.2(K) D7d.2(K) D7e.2(K) D7f.2(K) D10.2(K) D11.2(K) D71.2(K) D72.2(K) D73.2(K) D74.2(K) D75.2(K) D76.2(K) D77.2(K) D78.2(K) D79.2(K) D80.2(K) D81.2(K) D82.2(K) D83.2(K) D84.2(K) h573_1.20(VCC) h573_2.20(VCC) h573_3.20(VCC) P15.14 R1c.2 R3B.2 R4B.2 R5C.2 R6B.2 R100.2 REL1.8 REL2.8 REL7a.5 REL7d.5 REL7e.5 REL7f.5 REL71.5 REL72.5 REL73.5 REL74.5 REL75.5 REL76.5 REL77.5 REL78.5 REL79.5 REL80.5 REL81.5 REL82.5 REL83.5 REL84.5 U7.16(VCC) U20_573L.11(C) U20_573L.20(VCC) U22.7(VCCB1) U22.18(VCCB2) U_5v.3(Vin) usb1.1 usb2.1  [also labelled +5v, OS_2, VCC, VDD_5v, VDD_D1]
VC1: MCU.101(PA9/USART1_TX/TIM1_CH2) U7_1.16(A1)
VC2: MCU.100(PA8/USART1_CK/TIM1_CH1/MCO) U7_1.15(A0)
VC3: MCU.113(PC12/UART5_TX/SDIO_CK) U7_2.16(A1)
VC4: MCU.116(PD2/TIM3_ETR/UART5_RX/SDIO_CMD) U7_2.15(A0)
VCC3.3: AD7606_1.23 AD7606_2.23 AD7606_3.23 C3.2 C4.2 C5.2 C6.2 C7.2 C8.2 C9.2 C10.2 C11.2 C12.2 C13.2 C17.1 JTAG.1(VDD) JTAG.2(VDD) MCU.17(VDD) MCU.32(Vref+) MCU.33(VDDA) MCU.39(VDD) MCU.52(VDD) MCU.62(VDD) MCU.72(VDD) MCU.84(VDD) MCU.95(VDD) MCU.108(VDD) MCU.121(VDD) MCU.131(VDD) MCU.144(VDD) R2.1 R3.1 R4.1 R6.1 R6A.2 R7.1 R8.1 R9.1 U22.31(VCCA2) U22.42(VCCA1)
VDD33: 3.3V.2(OUTPUT) 3.3V.4(OUTPUT) C36.1 C36_1.1 C38.1 C38_1.1 R6A.1 U117_3.3.2(OUTPUT) U117_3.3.4(OUTPUT)
VDD_-5: C27.2 C28.2 U_-5v.3(Vout)
1A: R20.1 REL2.5
5A: R20_1.1 REL2.6
15J: AD7606_1.15 AD7606_2.15 AD7606_3.15
36J: AD7606_1.36 AD7606_2.36 AD7606_3.36
39J: AD7606_1.39 AD7606_2.39 AD7606_3.39
42J: AD7606_1.42 AD7606_2.42 AD7606_3.42
44J: AD7606_1.44 AD7606_2.44 AD7606_3.44
45J: AD7606_1.45 AD7606_2.45 AD7606_3.45
57.74: 100_57.74.2
100: 100_57.74.1 REL2.3
100/√3: REL2.2
-23V: P15.16 R70.2
/PAR: AD7606_1.6 AD7606_2.6 AD7606_3.6
/STBY: AD7606_1.7 AD7606_2.7 AD7606_3.7
A1: 74138.1(A) MCU.11(PF1/FSMC_A1)
A2: 74138.2(B) MCU.12(PF2/FSMC_A2)
A3: 74138.3(C) MCU.13(PF3/FSMC_A3)
A4: 74138_2.1(A) MCU.14(PF4/FSMC_A4)
A5: 74138_2.2(B) MCU.15(PF5/FSMC_A5)
A6: 74138_2.3(C) MCU.18(PF6/ADC3_IN4/FSMC_NIORD)
AC6.3: DDS_GND.2 JUMP.3 P1_1.9 P1_1.10 P1_2.9 P1_2.10 P1_3.9 P1_3.10 P2_1.9 P2_1.10 P2_2.9 P2_2.10 P2_3.9 P2_3.10 P3_1.9 P3_1.10 P3_2.9 P3_2.10 P3_3.9 P3_3.10 R_0.2 U12.6(OUT) U14.3(IN+)  [also labelled InputSX]
AD7545__CS1: 74138_2.15(Y0) AD7545_1.16(CS)
AD7545__CS2: 74138_2.10(Y5) U9.16(CS)
AD7545__CS3: 74138_2.14(Y1) AD7545_3.16(CS)
AD7545__CS4: 74138_2.13(Y2) AD7545_4.16(CS)
AD7545__CS5: 74138_2.12(Y3) AD7545_5.16(CS)
AD7545__CS6: 74138_2.11(Y4) AD7545_6.16(CS)
AD7606_CS1: 74138.15(Y0) AD7606_1.12 AD7606_1.13
AD7606_RD_CS2: 74138.14(Y1) AD7606_2.12 AD7606_2.13
AD7606_RD_CS3: 74138.13(Y2) AD7606_3.12 AD7606_3.13
AD_BUZY: MCU.102(PA10/USART1_RX/TIM1_CH3)
AD_BUZY1: AD7606_1.14 AD7606_2.14 AD7606_3.14
AD_CONV: AD7606_1.9 AD7606_1.10 AD7606_2.9 AD7606_2.10 AD7606_3.9 AD7606_3.10 MCU.99(PC9/TIM8_CH4/SDIO_D1)
ADRST: AD7606_1.11 AD7606_2.11 AD7606_3.11 h573_3.13(7Q)
COMB: BackInput.1 REL1.1 ; port COMB
COMC: COM.2 ; port COMC
CS2: MCU.124(PG9/FSMC_NE2/FSMC_NCE3) R46.2(R2)
CS3: MCU.125(PG10/FSMC_NCE4_1/FSMC_NE3)
CS4: MCU.127(PG12/FSMC_NE4)
Ctr1: CON8.6 CON9.6 CON10.6 CON11.6 R82#1.1
Ctr1_3: 1_2.6 h573_3.19(1Q)
Ctr1_4: 1_2.7 h573_3.18(2Q)
Ctr1_5: 1_3.6 h573_3.17(3Q)
Ctr1_6: 1_3.7 h573_3.16(4Q)
Ctr1_7: 1_1.6 h573_3.15(5Q)
Ctr1_8: 1_1.7 h573_3.14(6Q)
Ctr2: CON8.7 CON9.7 CON10.7 CON11.7 R7a.1 R7d.1 R7e.1 R7f.1 R71.1 R72.1 R73.1 R74.1 R75.1 R76.1 R77.1 R78.1 R81.1 R83.1 R84.1
Ctr2_3: 2_2.6 h573_1.19(1Q)
Ctr2_4: 2_2.7 h573_1.18(2Q)
Ctr2_5: 2_3.6 h573_1.17(3Q)
Ctr2_6: 2_3.7 h573_1.16(4Q)
Ctr2_7: 2_1.6 h573_1.15(5Q)
Ctr2_8: 2_1.7 h573_1.14(6Q)
Ctr3: R59.1
Ctr3_3: 3_2.6 h573_2.19(1Q)
Ctr3_4: 3_2.7 h573_2.18(2Q)
Ctr3_5: 3_3.6 h573_2.17(3Q)
Ctr3_6: 3_3.7 h573_2.16(4Q)
Ctr3_7: 3_1.6 h573_2.15(5Q)
Ctr3_8: 3_1.7 h573_2.14(6Q)
CurrentA: REL1.2 REL2.4 ; port CurrentA
D1+: MCU.104(PA12/USART1_RTS/CAN_TX/TIM1_ETR/USBDP) usb2.3
D1-: MCU.103(PA11/USART1_CTS/CAN_RX/TIM1_CH4/USBDM) usb2.2
D+: ch340.5(D+) usb1.3
D-: ch340.6(D-) usb1.2
DDS: R32.2 U12.2(IN-)
FSMC_A0: P15.5 U20_573L.19(1Q)
GB14: MCU.75(PB14/SPI2_MISO/USART3_RTS/TIM1_CH2N)
GPB15: MCU.76(PB15/SPI2_MOSI/I2S2_SD/TIM1_CH3N)
GPE0: MCU.141(PE0/TIM4_ETR/FSMC_NBL0)
GPE2: MCU.1(PE2/TRACECK/FSMC_A23)
GPE3: MCU.2(PE3/TRACED0/FSMC_A19)
IN1_1: AD7606_1.63 U7_2.11(Vo) U7_2.12(Feed)
IN1_2: AD7606_1.61 U7_1.11(Vo) U7_1.12(Feed)
IN1_3: 1_2.4 AD7606_1.59
IN1_4: 1_2.5 AD7606_1.57
IN1_5: 1_3.4 AD7606_1.55
IN1_6: 1_3.5 AD7606_1.53
IN1_7: 1_1.4 AD7606_1.51
IN1_8: 1_1.5 AD7606_1.49
IN2_1: AD7606_2.63 R5A.2
IN2_2: AD7606_2.61 R60.2
IN2_3: 2_2.4 AD7606_2.59
IN2_4: 2_2.5 AD7606_2.57
IN2_5: 2_3.4 AD7606_2.55
IN2_6: 2_3.5 AD7606_2.53
IN2_7: 2_1.4 AD7606_2.51
IN2_8: 2_1.5 AD7606_2.49
IN3_1: AD7606_3.63 R25.2
IN3_2: AD7606_3.61 R61.2
IN3_3: 3_2.4 AD7606_3.59
IN3_4: 3_2.5 AD7606_3.57
IN3_5: 3_3.4 AD7606_3.55
IN3_6: 3_3.5 AD7606_3.53
IN3_7: 3_1.4 AD7606_3.51
IN3_8: 3_1.5 AD7606_3.49
IN_1: CON11.5
IN_1_1: CON8.4 CON11.4
IN_1_2: CON8.5
IN_2: CON9.5
IN_2_1: CON9.4
IN_3: CON10.5
IN_3_1: CON10.4
IN_IA: R18.2 R26.2 R27.2 U2.6(OUT)  [also labelled v2]
IN_IB: R35.2 R62.2 R63.2 R65.2 R66.2 R67.2 R68.2
Input: U117_3.3.3(INPUT)
InputCMP: 2.7(QD) U7.3(BIN)
ISIN: CT4.3 ; port ISIN
JTCK: JTAG.9(TCK/SWCLK) MCU.109(PA14/JTCK_SWCLK) R5.2
JTDI: JTAG.5(TDI) MCU.110(PA15/JTDI/SPI3_NSS/I2S3_WS) R4.2
JTDO: JTAG.13(TDO/SWO) MCU.133(PB3/JTDO/TRACESWO/SPI3_SCK/I2S3_CK) R7.2  [also labelled PB3]
JTMS: JTAG.7(TMS/SWDIO) MCU.105(PA13/JTMS_SWDIO) R6.2
JTRST: JTAG.3(TRST) MCU.134(PB4/JNTRST/SPI3_MISO) R3.2  [also labelled PB4]
LCS: P15.4 U20_573L.18(2Q)
LED1: LD1.2(K) MCU.20(PF8/ADC3_IN6/FSMC_NIOWR)
LED2: LD2.2(K) MCU.21(PF9/ADC3_IN7/FSMC_CD)
LRest: MCU.45(PC5/ADC12_IN15) R47.1(R1)
MOSI: D3.2(K) MCU.43(PA7/SPI1_MOSI/TIM8_CH1N/ADC12_IN7/TIM3_CH2) R12.2
NOE: MCU.118(PD4/FSMC_NOE) R46.4(R4)
NWE: MCU.119(PD5/FSMC_NWE) R46.3(R3)
OE: 74138.4(~{E1}) 74138.5(~{E2}) P15.2 R11.2 U20_573L.16(4Q)  [also labelled RD-OUT]
Outa: BackOut.2 R20.2 R20_1.2 R26.1 U4.6(OUT)  [also labelled v4]
Outb: BackOut.1 CT3.1 D6.2(K) D7.1(A) U4.2(IN-)
PB5: h573_1.2(1D) h573_2.2(1D) h573_3.2(1D) MCU.135(PB5/I2C1_SMBAI/SPI3_MOSI/I2S3_SD)
PB6: h573_1.3(2D) h573_2.3(2D) h573_3.3(2D) MCU.136(PB6/I2C1_SCL/TIM4_CH1)
PB7: h573_1.4(3D) h573_2.4(3D) h573_3.4(3D) MCU.137(PB7/I2C1_SDA/FSMC_NADV/TIM4_CH2)
PB8: h573_1.5(4D) h573_2.5(4D) h573_3.5(4D) MCU.139(PB8/TIM4_CH3/SDIO_D4)
PB9: h573_1.6(5D) h573_2.6(5D) h573_3.6(5D) MCU.140(PB9/TIM4_CH4/SDIO_D5)
PB10: h573_1.7(6D) h573_2.7(6D) h573_3.7(6D) MCU.69(PB10/I2C2_SCL/USART3_TX)
PB11: h573_1.11(C) MCU.70(PB11/I2C2_SDA/USART3_RX)
PB12: h573_2.11(C) MCU.73(PB12/SPI2_NSS/I2S2_WS/I2C2_SMBAI/USART3_CK/TIM1BKIN)
PB13: h573_3.11(C) MCU.74(PB13/SPI2_SCK/I2S2_CK/USART3_CTS/TIM1_CH1N)
RANGE: AD7606_1.8 AD7606_2.8 AD7606_3.8
ref: AD7545_1.19(Vref) AD7545_3.19(Vref) AD7545_4.19(Vref) AD7545_5.19(Vref) AD7545_6.19(Vref) C20.1 C21.1 R37.1 R38.2 U9.19(Vref) U13.2(A)
REF_SELECT: AD7606_1.34 AD7606_2.34 AD7606_3.34
RESET: C14.2 JTAG.15(RESET#) MCU.25(NRST) R2.2
rftb: AD7545_1.20(Rfb) AD7545_3.20(Rfb) AD7545_4.20(Rfb) AD7545_5.20(Rfb) AD7545_6.20(Rfb) C4B.2 C5A.2 C6a.2 C23.2 P1_1.7 P1_1.8 P1_2.7 P1_2.8 P1_3.7 P1_3.8 P2_1.7 P2_1.8 P2_2.7 P2_2.8 P2_3.7 P2_3.8 R40.2 R43.2 U4A.6(OUT) U5A.6(OUT) U6A.6(OUT) U9.20(Rfb) U11.6(OUT)
rftb3_1: C1d.2 P3_2.7 P3_2.8 P3_3.7 P3_3.8 U1A.6(OUT)
rftb3_2: C3A.2 P3_1.7 P3_1.8 U3A.6(OUT)
RS: MCU.10(PF0/FSMC_A0) R46.1(R1)
RST_LCD: C51.1 P15.1 U20_573L.15(5Q)
rx: ch340.2(TXD) MCU.112(PC11/UART4_RX/SDIO_D3)
s7606RST: h573_3.8(7D) MCU.35(PA1/USART2_RTS/ADC123_IN1/TIM5_CH2/TIM2_CH2)
Sing: MCU.19(PF7/ADC3_IN5/FSMC_NREG) R45.1 Sing_GND.2 U7.14(AIN) U14.6(OUT)
SN_OE: MCU.26(PC0/ADC123_IN10)
SPI1_NSS: MCU.40(PA4/SPI1_NSS/DAC_OUT1/USART2_CK/ADC12_IN4) R47.3(R3)
SPI1_SCK: MCU.41(PA5/SPI1_SCK/DAC_OUT2/ADC12_IN5) R47.2(R2)
SPI1_SO: MCU.42(PA6/SPI1_MISO/TIM8_BKIN/ADC12_IN6/TIM3_CH1) R47.4(R4)
stAD1: MCU.27(PC1/ADC123_IN11) R43.1 R44.2
stAD2: MCU.28(PC2/ADC123_IN12)
stAD3: MCU.29(PC3/ADC123_IN13)
stAD4: MCU.44(PC4/ADC12_IN14)
TSCK: P15.18 U20_573L.14(6Q)
TSCS: P15.21 U20_573L.13(7Q)
TSDI: P15.20 U20_573L.12(8Q)
TSDO: P15.19 R12.1
TSINT: P15.22 R112.1
TSINT1: D13.2(K) MCU.91(PG6/FSMC_INT2) R112.2
tx: ch340.3(RXD) MCU.111(PC10/UART4_TX/SDIO_D2)
USART2_RX: MCU.37(PA3/USART2_RX/ADC123_IN3/TIM5_CH4/TIM2_CH4)
USART2_TX: MCU.36(PA2/USART2_TX/ADC123_IN2/TIM5_CH3/TIM2_CH3)
v5: R21.2 R27.1 U5.6(OUT)
v8: CT11.2 R35.1 R62.1 R63.1 R64.1 R65.1 R66.1 R67.1 R68.1 TR3.2 TR4.2 TR5.2 TR6.2 TR7.2 TR8.2 TR9.2
VO: P15.17 R70.3(W)
VoltageA: REL1.3 REL2.1 ; port VoltageA
WR-OUT: 74138_2.4(~{E1}) 74138_2.5(~{E2}) AD7545_1.17(WR) AD7545_3.17(WR) AD7545_4.17(WR) AD7545_5.17(WR) AD7545_6.17(WR) P15.3 U9.17(WR) U20_573L.17(3Q)
Net1_5: 1.5(CU) U7.4(VCOUT)
Net1_12: 1.12(TCU) R14.1
Net2_5: 2.5(CU) R14.2
NetAD7545_1_1: AD7545_1.1(OUT-1) U1A.2(IN-)
NetAD7545_1_18: AD7545_1.18(Vdd) C1b.1 R1c.1
NetAD7545_3_1: AD7545_3.1(OUT-1) U3A.2(IN-)
NetAD7545_3_18: AD7545_3.18(Vdd) C3B.1 R3B.1
NetAD7545_4_1: AD7545_4.1(OUT-1) U4A.2(IN-)
NetAD7545_4_18: AD7545_4.18(Vdd) C4C.1 R4B.1
NetAD7545_5_1: AD7545_5.1(OUT-1) U5A.2(IN-)
NetAD7545_5_18: AD7545_5.18(Vdd) C5B.1 R5C.1
NetAD7545_6_1: AD7545_6.1(OUT-1) U6A.2(IN-)
NetAD7545_6_18: AD7545_6.18(Vdd) C6b.1 R6B.1
NetC1_2: C1.2 MCU.24(OSC_OUT) Y1.2(OSC2)
NetC2_2: C2.2 MCU.23(OSC_IN) Y1.1(OSC1)
NetC18_2: C18.2 R16.1
NetC19_1: C19.1 U7.6(CA)
NetC19_2: C19.2 U7.7(CB)
NetC24_1: C24.1 R100.1 U9.18(Vdd)
NetC31_1: C31.1 C32.1 D17.2(K) D18.2(K)
NetC39_1: C39.1 CT7.3
NetC39_2: C39.2 CT7.4
NetC46_1: C46.1 ch340.4(V3)
NetC47_2: C47.2 ch340.8(X0) Y2.1
NetC48_2: C48.2 ch340.7(X1) Y2.2
NetCON1_1: CON1.1 CON2.1 CT11.3 J20_9.1
NetCT1_1: CT1.1 D1.2(K) D2.1(A) R18.1 U2.2(IN-)
NetCT2_1: CT2.1 D4.2(K) D5.1(A) R19.1 U3.2(IN-)
NetCT2_3: CT2.3 Tol_Cur1_1.1
NetCT2_4: CT2.4 Tol_Cur1_2.1
NetCT4_1: CT4.1 D8.2(K) D9.1(A) R21.1 U5.2(IN-)
NetCT7_1: CT7.1 D16.2(K) D17.1(A)
NetCT7_2: CT7.2 D14.2(K) D18.1(A) R32.1
NetCT11_4: CT11.4 J20_9.2
NetCT23_1: CT23.1 D27.2(K) D28.1(A) R53.1 U24.2(IN-)
NetCT27_1: CT27.1 D35.2(K) D36.1(A) R57.1 U28.2(IN-)
NetD7a_1: D7a.1(A) Q7a.3(C) REL7a.4
NetD7d_1: D7d.1(A) Q7d.3(C) REL7d.4
NetD7e_1: D7e.1(A) Q7e.3(C) REL7e.4
NetD7f_1: D7f.1(A) Q7f.3(C) REL7f.4
NetD10_1: D10.1(A) QNPN.2(C) REL1.7
NetD11_1: D11.1(A) QNPN1.2(C) REL2.7
NetD71_1: D71.1(A) Q71.3(C) REL71.4
NetD72_1: D72.1(A) Q72.3(C) REL72.4
NetD73_1: D73.1(A) Q73.3(C) REL73.4
NetD74_1: D74.1(A) Q74.3(C) REL74.4
NetD75_1: D75.1(A) Q75.3(C) REL75.4
NetD76_1: D76.1(A) Q76.3(C) REL76.4
NetD77_1: D77.1(A) Q77.3(C) REL77.4
NetD78_1: D78.1(A) Q78.3(C) REL78.4
NetD79_1: D79.1(A) Q79.3(C) REL79.4
NetD80_1: D80.1(A) Q80.3(C) REL80.4
NetD81_1: D81.1(A) Q81.3(C) REL81.4
NetD82_1: D82.1(A) Q82.3(C) REL82.4
NetD83_1: D83.1(A) Q83.3(C) REL83.4
NetD84_1: D84.1(A) Q84.3(C) REL84.4
NetJUMP_2: JUMP.2 R_2.1
NetJUMP_4: JUMP.4 R_0.1 R_2.2 U12.3(IN+)
NetLD1_1: LD1.1(A) R8.2
NetLD2_1: LD2.1(A) R9.2
NetLD3_1: LD3.1(A) R45.2
NetMCU_138: MCU.138(BOOT0) R1.1
NetP1_1_11: P1_1.11 P1_1.12
NetP1_1_13: P1_1.13 P1_1.14
NetP1_2_11: P1_2.11 P1_2.12
NetP1_2_13: P1_2.13 P1_2.14
NetP1_3_11: P1_3.11 P1_3.12
NetP1_3_13: P1_3.13 P1_3.14
NetP2_1_11: P2_1.11 P2_1.12
NetP2_1_13: P2_1.13 P2_1.14
NetP2_2_11: P2_2.11 P2_2.12
NetP2_2_13: P2_2.13 P2_2.14
NetP2_3_11: P2_3.11 P2_3.12
NetP2_3_13: P2_3.13 P2_3.14
NetP3_1_11: P3_1.11 P3_1.12
NetP3_1_13: P3_1.13 P3_1.14
NetP3_2_11: P3_2.11 P3_2.12
NetP3_2_13: P3_2.13 P3_2.14
NetP3_3_11: P3_3.11 P3_3.12
NetP3_3_13: P3_3.13 P3_3.14
NetQ7a_2: Q7a.2(B) R7a.2
NetQ7d_2: Q7d.2(B) R7d.2
NetQ7e_2: Q7e.2(B) R7e.2
NetQ7f_2: Q7f.2(B) R7f.2
NetQ71_2: Q71.2(B) R71.2
NetQ72_2: Q72.2(B) R72.2
NetQ73_2: Q73.2(B) R73.2
NetQ74_2: Q74.2(B) R74.2
NetQ75_2: Q75.2(B) R75.2
NetQ76_2: Q76.2(B) R76.2
NetQ77_2: Q77.2(B) R77.2
NetQ78_2: Q78.2(B) R78.2
NetQ79_2: Q79.2(B) R79.2
NetQ80_2: Q80.2(B) R80.2
NetQ81_2: Q81.2(B) R81.2
NetQ82_2: Q82.2(B) R82#2.2
NetQ83_2: Q83.2(B) R83.2
NetQ84_2: Q84.2(B) R84.2
NetQNPN1_1: QNPN1.1(B) R59.2
NetQNPN_1: QNPN.1(B) R82#1.2
NetR5A_1: R5A.1 R57.2 U28.6(OUT)
NetR10_1: R10.1 U22.25(2~{OE}) U22.48(1~{OE})
NetR11_1: R11.1 U22.1(1DIR) U22.24(2DIR)
NetR15_1: R15.1 U7.13(PC2)
NetR15_2: R15.2 R16.2 U7.9(VCIN)
NetR17_2: R17.2 U7.11(R1)
NetR19_2: R19.2 R25.1 U3.6(OUT)
NetR36_1: R36.1 R37.2 U13.1(REF)
NetR46_5: R46.5(R4) U20_573L.5(4D)
NetR46_6: R46.6(R3) U20_573L.4(3D)
NetR46_7: R46.7(R2) U20_573L.3(2D)
NetR46_8: R46.8(R1) U20_573L.2(1D)
NetR47_5: R47.5(R4) U20_573L.9(8D)
NetR47_6: R47.6(R3) U20_573L.8(7D)
NetR47_7: R47.7(R2) U20_573L.7(6D)
NetR47_8: R47.8(R1) U20_573L.6(5D)
NetR53_2: R53.2 U7_2.5(V+in) U24.6(OUT)
NetR60_1: R60.1 TR1.2
NetR61_1: R61.1 TR2.2
NetR64_2: R64.2 U7_1.5(V+in)
NetU9_1: U9.1(OUT-1) U11.2(IN-)

Not connected (* = marked no-connect by the designer): 1 2(QB) 3(Q0) 6(QC) 7(QD) 13(TCD); 2 2(QB) 3(Q0) 6(QC) 12(TCU) 13(TCD); 3.3V 3(INPUT); 3_1 8; 74138 7(Y7) 9(Y6) 10(Y5) 11(Y4) 12(Y3); 74138_2 7(Y7) 9(Y6); AD7606_3 38; BackInput 2; ch340 9(CTS#) 10(DSR#) 11(R1#) 12(DCD) 13(DTR) 14(RTS) 15(R232); CON3 1; CON4 1; CT1 3 4; CT3 3 4; CT4 4; CT14 1* 2* 3*; CT23 3 4; CT27 3 4; FSMC 17 18 19 20; h573_1 8(7D) 9(8D) 12(8Q) 13(7Q); h573_2 8(7D) 9(8D) 12(8Q) 13(7Q); h573_3 9(8D) 12(8Q); JTAG 11(NC) 17(NC) 19(NC); JUMP 5 6; MCU 3(PE4/TRACED1/FSMC_A20) 4(PE5/TRACED2/FSMC_A21) 5(PE6/TRACED3/FSMC_A22) 6(VBAT) 7(PC13-TAMPER-RTC) 8(PC14-OSC32_IN) 9(PC15-OSC32_OUT) 22(PF10/ADC3_IN8/FSMC_INTR) 34(PA0-WKUP/USART2_CTS/ADC123_IN0/TIM5_CH1/TIM2_CH1_ETR/TIM8_ETR) 46(PB0/ADC12_IN8/TIM3_CH3/TIM8_CH2N) 47(PB1/ADC12_IN9/TIM3_CH4/TIM8_CH3N) 48(PB2/BOOT1) 49(PF11/FSMC_NIOS16) 50(PF12/FSMC_A6) 53(PF13/FSMC_A7) 54(PF14/FSMC_A8) 55(PF15/FSMC_A9) 56(PG0/FSMC_A10) 57(PG1/FSMC_A11) 80(PD11/FSMC_A16) 81(PD12/FSMC_A17) 82(PD13/FSMC_A18) 87(PG2/FSMC_A12) 88(PG3/FSMC_A13) 89(PG4/FSMC_A14) 90(PG5/FSMC_A15) 92(PG7/FSMC_INT3) 93(PG8) 96(PC6/I2S2_MCK/TIM8_CH1/SDIO_D6) 97(PC7/I2S3_MCK/TIM8_CH2/SDIO_D7) 98(PC8/TIM8_CH3/SDIO_D0) 106(NC) 117(PD3/FSMC_CLK) 122(PD6/FSMC_NWAIT) 123(PD7/FSMC_NE1/FSMC_NCE2) 126(PG11/FSMC_NCE4_2) 128(PG13/FSMC_A24) 129(PG14/FSMC_A25) 132(PG15) 142(PE1/FSMC_NBL1); P3 1 2 3 4 5 6 7 8 9 10 11 12; P15 23 24 25 26; power 1(AC) 2(AC); Power_I 1(+) 2(GND) 3(GND); R40 1; R79 1; R80 1; R82#2 1*; REL1 4 5 6; REL7a 1 2 3; REL7d 1 2 3; REL7e 1 2 3; REL7f 1 2 3; REL71 1 2 3; REL72 1 2 3; REL73 1 2 3; REL74 1 2 3; REL75 1 2 3; REL76 1 2 3; REL77 1 2 3; REL78 1 2 3; REL79 1 2 3; REL80 1 2 3; REL81 1 2 3; REL82 1 2 3; REL83 1 2 3; REL84 1 2 3; TR1 3 4; TR2 3 4; TR3 3 4; TR4 3 4; TR5 3 4; TR6 3 4; TR7 3 4; TR8 3 4; TR9 3 4; U1A 1(NULL1) 5(NC) 8(NULL2); U2 1(NULL1) 4(V-) 5(NC) 8(NULL2); U3 1(NULL1) 5(NC) 8(NULL2); U3A 1(NULL1) 5(NC) 8(NULL2); U4 1(NULL1) 5(NC) 8(NULL2); U4A 1(NULL1) 5(NC) 8(NULL2); U5 1(NULL1) 5(NC) 8(NULL2); U5A 1(NULL1) 5(NC) 8(NULL2); U6A 1(NULL1) 5(NC) 8(NULL2); U7 1(PCP) 2(PC1) 10(SF) 12(R2) 15(ZEN); U7_1 1(Vo1) 2(NC) 3(NC) 6(Vos) 7(Vos) 9(Vo2); U7_2 1(Vo1) 2(NC) 3(NC) 6(Vos) 7(Vos) 9(Vo2); U11 1(NULL1) 5(NC) 8(NULL2); U12 1(NULL1) 5(NC) 8(NULL2); U14 1(NULL1) 5(NC) 8(NULL2); U24 1(NULL1) 4(V-) 5(NC) 8(NULL2); U28 1(NULL1) 5(NC) 8(NULL2); usb1 4; usb2 4; Vback 1 2

## Notes on the sheet
- 电流检测电路
- 电流，电压反馈切换电路
- usb转串口
- 单片机控制
- 锁相环倍频电路
- DA转换
- 电源接口
- 液晶显示
- 电压检测电路
- 电子元电接口
- 模拟电源
- Labels drawn without touching a wire or pin: -15V, -15v, Ctr2, DGND, SGND, TSDI, WR_7545
- (in symbol CAPACITOR POL) +

## Library data of the parts
1 2 = 74LS192
1_1-1_3 2_1-2_3 3_1-3_3 CON8-CON11 = CON8: Connector
3.3V U117_3.3 = LM1117
100_57.74 +5v_GND +5v_SGND -15V_+15V BackInput BackOut COM DDS_GND Sing_GND Vback = CON2: Connector
+15V_-15V = CON4: Connector
AD7545_1 AD7545_3-AD7545_6 U9 = AD7545
C1b C1d C3A C3B C4a C4B C4C C5A C5B C6a C6b C7a C7d C7e C7f C19 C23 C24 C26 C28 C34 C35 C42 C44-C49 C51 C71-C84 = CAP: Capacitor
C16 C17 C32 C33_1 C33_2 C34_1 C34_2 C38 C38_1 C39 C63 = Cap: Capacitor; Value: 0.1u; Published: 8-Jun-2000; LatestRevisionDate: 17-Jul-2002; LatestRevisionNote: Re-released for DXP Platform.; Publisher: Altium Limited
  C16 C17 C32 C38 C38_1 C39 C63: PackageReference: RAD-0.3
C20-C22 = Cap_5: Capacitor; Value: 0.1u; Published: 8-Jun-2000; LatestRevisionDate: 17-Jul-2002; LatestRevisionNote: Re-released for DXP Platform.; Publisher: Altium Limited
C27 C43 = CAPACITOR POL: Capacitor
C31 C36 C36_1 = Cap2: Capacitor; Value: 0.1u; Published: 23-Sep-2002; Publisher: Altium Limited
ch340 = CH340G
CON1-CON4 Tol_Cur1_1 Tol_Cur1_2 = CON1: Connector
D1 D2 D4-D9 D14 D16-D18 D27 D28 D35 D36 = Diode 1N4007: 1 Amp General Purpose Rectifier; Published: 8-Jun-2000; LatestRevisionDate: 17-Jul-2002; LatestRevisionNote: Re-released for DXP Platform.; DatasheetDocument: 1998; PackageDocument: Aug-1999; PackageReference: DO-41; Publisher: Altium Limited; Code_JEDEC: DO-204-AL; ComponentLink1Description: Manufacturer Link; ComponentLink1URL: http://www.fairchildsemi.com/; ComponentLink2Description: Datasheet; ComponentLink2URL: http://www.fairchildsemi.com/ds/1N%2F1N4001.pdf
D3 D13 = DIODE SCHOTTKY: Schottky Diode
D7a D7d D7e D7f D71-D84 = DIODE
FSMC = 20PIN1
h573_1-h573_3 U20_573L = 74HC573
J20_9 = CON2: Connector; pin to pad: 2>3
JTAG = JTAG
JUMP = Header 3X2H: Header, 3-Pin, Dual row, Right Angle; LatestRevisionDate: 17-Jul-2002; LatestRevisionNote: Re-released for DXP Platform.; Publisher: Altium Limited
LD1 LD2 = LED2: Typical RED, GREEN, YELLOW, AMBER GaAs LED; Published: 8-Jun-2000; Revision: July-2002: Re-released for DXP Platform.; Publisher: Altium Limited
LD3 = LED2: Typical RED, GREEN, YELLOW, AMBER GaAs LED; pin to pad: 1>2 2>1; Published: 8-Jun-2000; Revision: July-2002: Re-released for DXP Platform.; Publisher: Altium Limited
P1_1-P1_3 P2_1-P2_3 P3_1-P3_3 = MHDR2X7: Header, 7-Pin, Dual row; LatestRevisionDate: 17-Jul-2002; LatestRevisionNote: Re-released for DXP Platform.; Publisher: Altium Limited
P3 = Header 12: Header, 12-Pin; LatestRevisionDate: 17-Jul-2002; LatestRevisionNote: Re-released for DXP Platform.; Publisher: Altium Limited
P15 = 26PIN
pin16 = CON16: Connector
power = Power: pin to pad: 1>4 2>3 3>2 4>1 5>0
Power_I = PJ202A
Q7a Q7d Q7e Q7f Q71-Q84 = 2N3904: NPN General Purpose Amplifier; pin to pad: 1>2 2>1; Published: 8-Jun-2000; LatestRevisionDate: 15-Jan-2003; LatestRevisionNote: PCB Footprint 'BCY-W3/D4.7' replaced; DatasheetDocument: 1997; PackageDocument: Sep-1998; PackageReference: TO-92A; Publisher: Altium Limited; Code_JEDEC: TO-92A; ComponentLink1Description: Manufacturer Link; ComponentLink1URL: http://www.fairchildsemi.com/; ComponentLink2Description: Datasheet; ComponentLink2URL: http://www.fairchildsemi.com/ds/2N%2F2N3904.pdf
QNPN QNPN1 = NPN1: NPN Transistor; pin to pad: 2>3 3>2
R1 R1c R3 R3B R4 R4B R5 R5C R6 R6B R7-R9 R43-R45 R100 = R
R1A R10 R11 = Res
R5A R18-R20 R20_1 R21 R25-R27 R53 R57 = RES2
R7a R7d R7e R7f R12 R59 R71-R81 R82#1 R82#2 R83 R84 R112 = Res2: Resistor; Value: 15K; Published: 8-Jun-2000; LatestRevisionDate: 17-Jul-2002; LatestRevisionNote: Re-released for DXP Platform.; PackageReference: AXIAL-0.4; Publisher: Altium Limited
R14 R15 R32 R35 R60-R68 R_0 R_2 = Res2: Resistor; Value: 47K; Published: 8-Jun-2000; LatestRevisionDate: 17-Jul-2002; LatestRevisionNote: Re-released for DXP Platform.; PackageReference: AXIAL-0.4; Publisher: Altium Limited
R16 R17 = Res2: Resistor; Published: 8-Jun-2000; LatestRevisionDate: 17-Jul-2002; LatestRevisionNote: Re-released for DXP Platform.; PackageReference: AXIAL-0.4; Publisher: Altium Limited; Value: 47K
R36-R38 R40 = RES
R46 R47 = RP4R: Text Field1: 30; Text Field2: 50
R70 = RESVR: Potentiometer; pin to pad: 1>0 2>1 3>2
REL1 REL2 = RELAY-DPDT
U1A U2 U3 U3A U4 U4A U5 U5A U6A U11 U12 U14 U24 U28 = OP07CN: Very Low Offset Single Bipolar Operational Amplifier; Text Field6: Pins 5 is Not Connected; Text Field7: Published 24-Aug-2001
U7_1 U7_2 = PGA205: Text Field1: PGA205
U13 = TL431ACLP: Programmable Precision Reference; PackageDocument: 1996; Published: 15-Apr-2002; DatasheetDocument: 1999; PackageReference: 29-04; Publisher: Altium Limited
U22 = IC_SN74ALVC164245
U_5v = LM1086
U_-5v = VOLTREG: pin to pad: 1>2 2>1
usb1 usb2 = CON5: Connector
Y1 = XTAL: Crystal Oscillator; Published: *; LatestRevisionDate: *; LatestRevisionNote: *; Publisher: *
Y2 = CRYSTAL